# Altium project CorrosenseBoard_V4.2.PrjPcb (part 1 of 2)
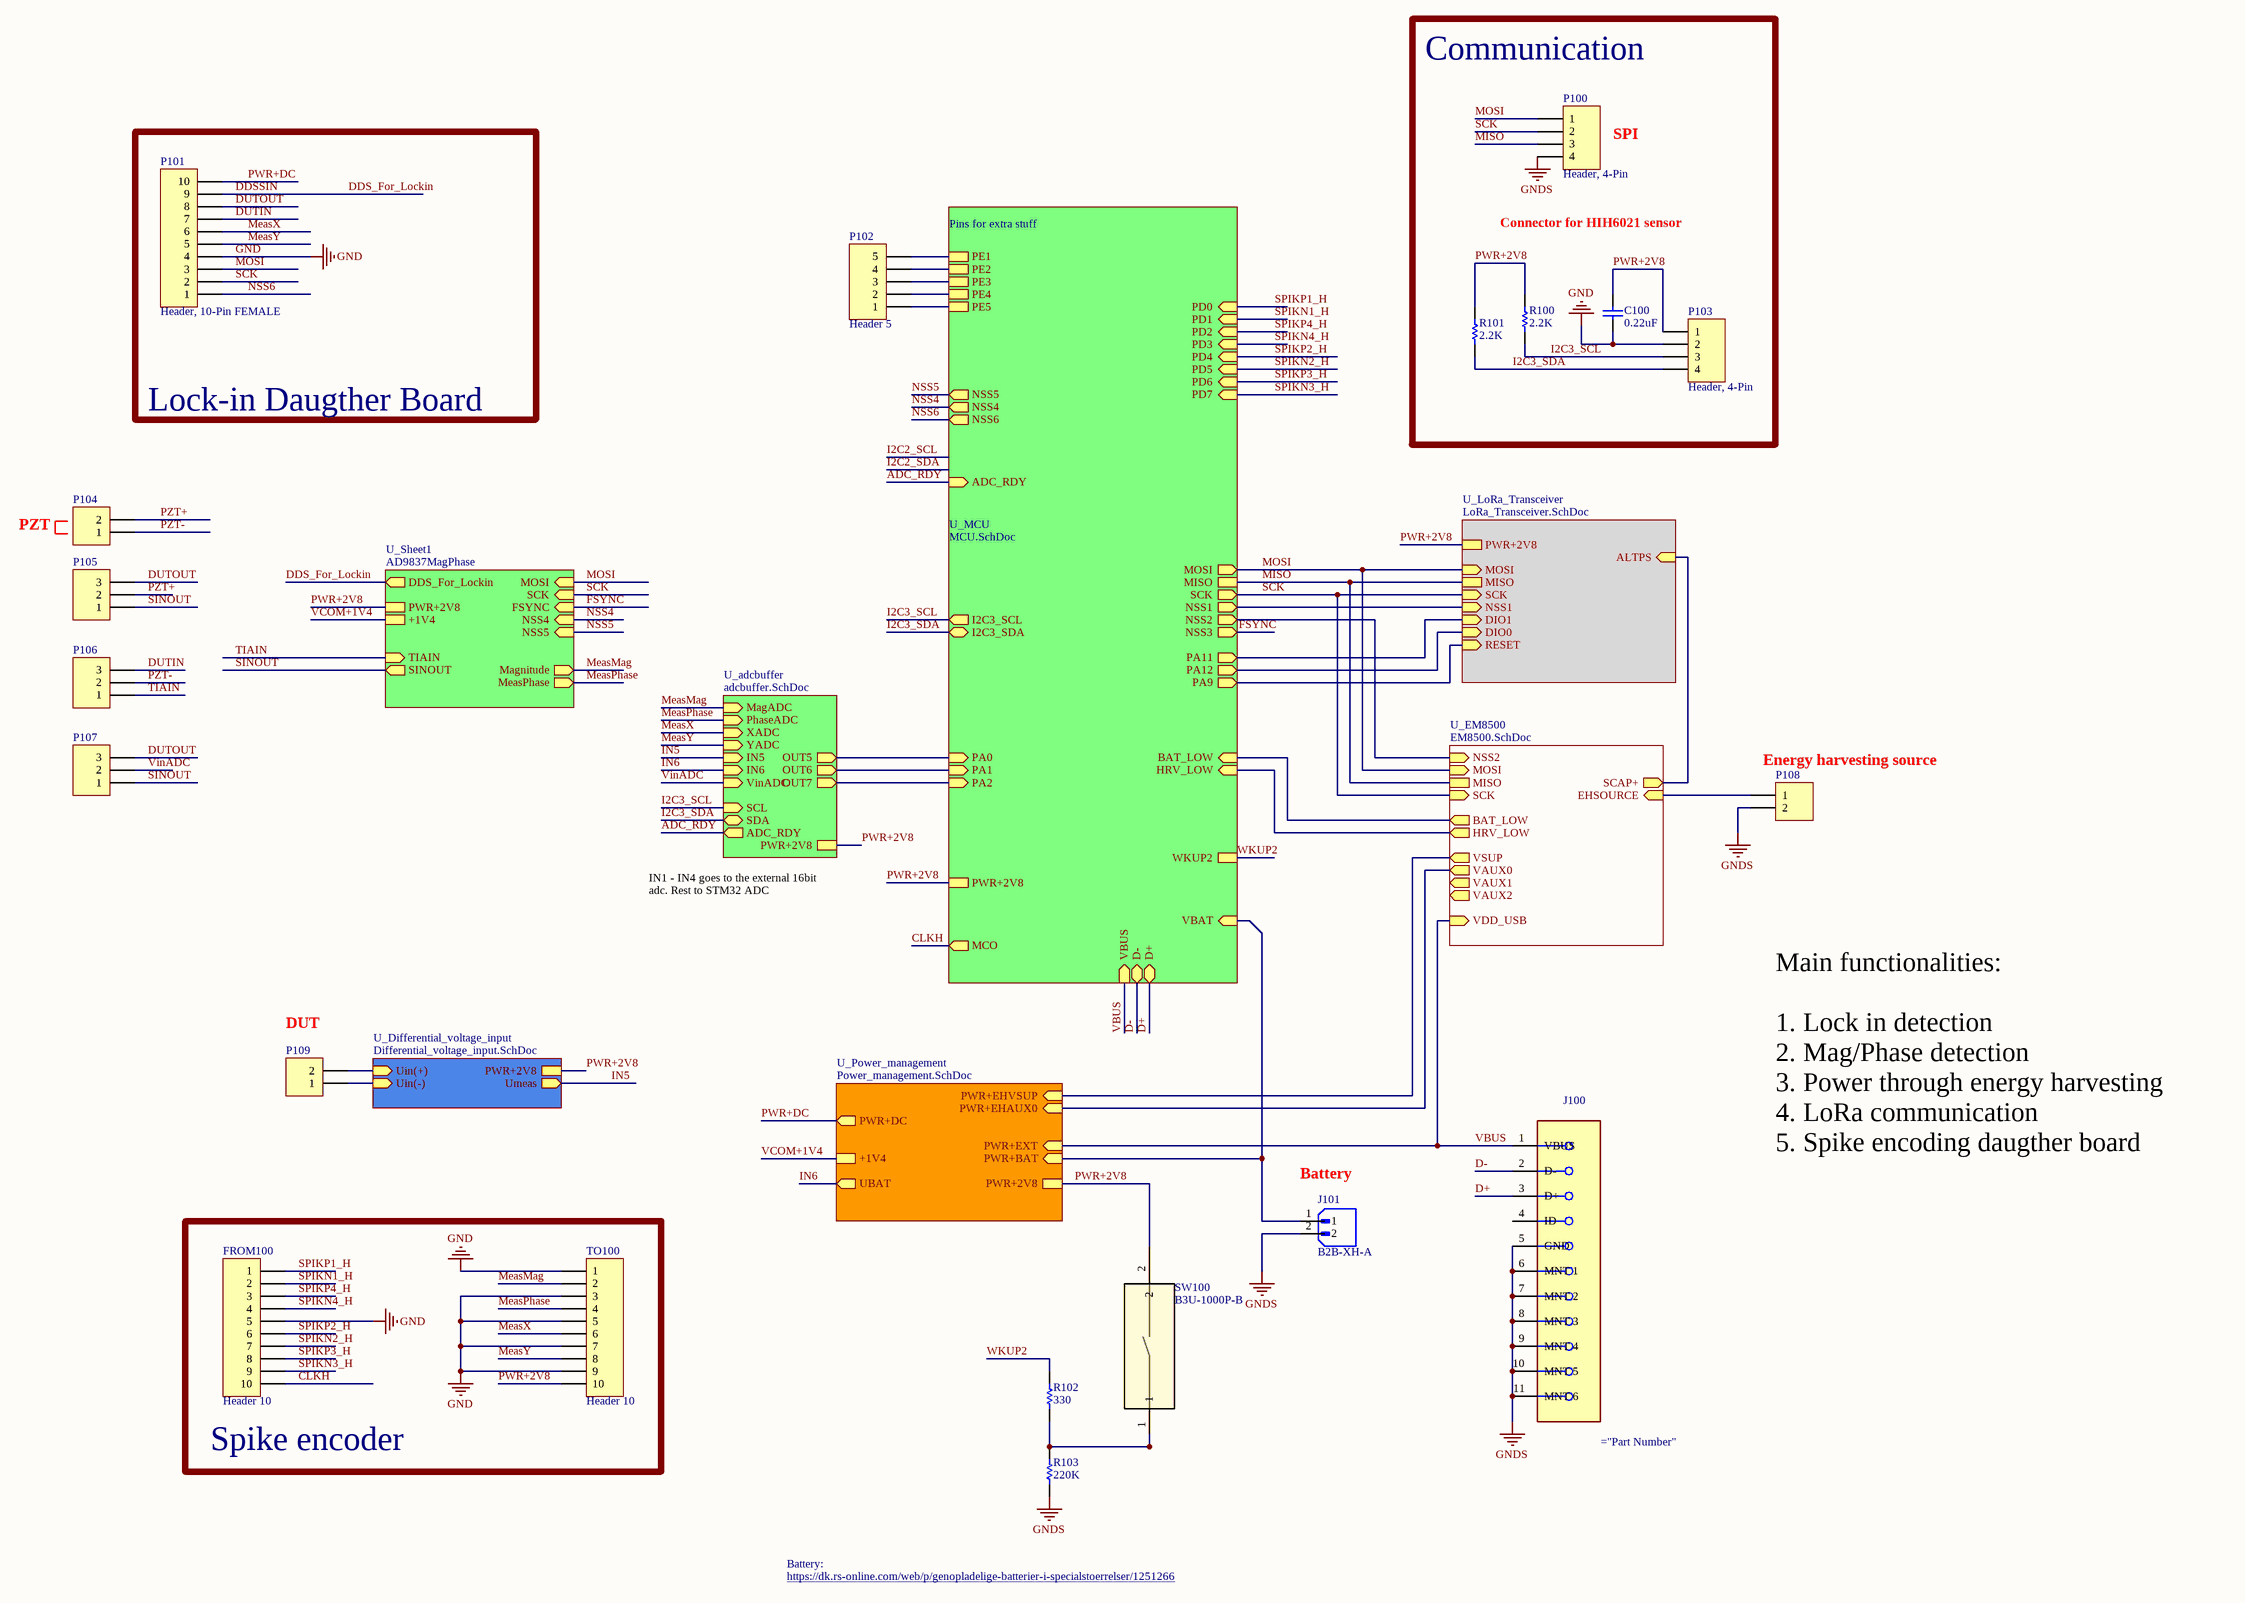
[diagram p0: CorrosenseBoard_V4.2.SchDoc]
8 sheets, 145 parts. Net scope: hierarchical (ports join the sheet entries above them; power ports are global).
Board file: CorrosenseBoardV4_3.PcbDoc
Sheets:
  CorrosenseBoard_V4.2.SchDoc
    U_adcbuffer = adcbuffer.SchDoc
    U_Differential_voltage_input = Differential_voltage_input.SchDoc
    U_EM8500 = EM8500.SchDoc
    U_MCU = MCU.SchDoc
    U_LoRa_Transceiver = LoRa_Transceiver.SchDoc
    U_Power_management = Power_management.SchDoc
    U_Sheet1 = AD9837MagPhase.SchDoc

## Sheet CorrosenseBoard_V4.2.SchDoc
size A2; SheetNumber: 1; SheetTotal: 8; SPICEModelCacheKYAFNCOO: <root> / <DocumentId>KYAFNCOO</DocumentId> / </root>

### Parts
C100  0.22uF  [1608[0603]]
FROM100  Header 10  [HDR1X10]
J100  0473460001  [Molex_0473460001_0]  (value not drawn)
J101  B2B-XH-A  [JST_B2B-XH-A]
P100  Header, 4-Pin  [HDR1X4]
P101  Header, 10-Pin FEMALE  [HDR1X10]
P102  Header 5  [HDR1X5]
P103  Header, 4-Pin  [HDR1X4]
P104  Header, 2-Pin  [HDR1X2]  (value not drawn)
P105  Header, 3-Pin  [HDR1X3]  (value not drawn)
P106  Header, 3-Pin  [HDR1X3]  (value not drawn)
P107  Header, 3-Pin  [HDR1X3]  (value not drawn)
P108  Header, 2-Pin  [HDR1X2]  (value not drawn)
P109  Header, 2-Pin  [HDR1X2]  (value not drawn)
R100  2.2K  [1608[0603]]
R101  2.2K  [1608[0603]]
R102  330  [1608[0603]]
R103  220K  [1608[0603]]
SW100  B3U-1000P-B  [B3U-1000P-B]
TO100  Header 10  [HDR1X10]

### Blocks framed on the sheet
Communication: C100 P100 P103 R100 R101
Lock-in Daugther Board: P101
Spike encoder: FROM100 TO100

### Sub-sheets
U_adcbuffer = adcbuffer.SchDoc: MagADC (in), PhaseADC (in), XADC (in), YADC (in), IN5 (in), OUT5 (out), IN6 (in), OUT6 (out), VinADC (in), OUT7 (out), PWR+2V8, SCL (in), SDA (bidir), ADC_RDY (out)
U_Differential_voltage_input = Differential_voltage_input.SchDoc: Umeas (out), Uin(-) (in), Uin(+) (in), PWR+2V8
U_EM8500 = EM8500.SchDoc: MOSI (in), SCK (in), SCAP+ (out), VAUX2 (out), VAUX1 (out), VAUX0 (out), VSUP (out), BAT_LOW (out), HRV_LOW (out), VDD_USB (in), EHSOURCE (in), NSS2 (in), MISO
U_LoRa_Transceiver = LoRa_Transceiver.SchDoc: ALTPS (in), MOSI (in), SCK (in), RESET (in), NSS1 (in), DIO1 (in), DIO0 (in), PWR+2V8, MISO
U_MCU = MCU.SchDoc: PA0 (in), PA1 (in), PD2 (in), PA9 (out), PA11 (out), PA12 (out), WKUP2, MOSI (out), MISO, SCK (out), NSS1 (out), NSS3 (out), NSS2 (out), VBUS (in), D- (bidir), D+ (bidir), PWR+2V8, VBAT (in), I2C3_SCL (out), I2C3_SDA (bidir), PA2 (in), PD0 (in), PD1 (in), PD3 (in), PD4 (in), PD5 (in), PD6 (in), PD7 (in), PE1, PE2, PE3, PE4, PE5, NSS4 (out), NSS5 (out), ADC_RDY (in), NSS6 (out), MCO (out), HRV_LOW (in), BAT_LOW (in)
U_Power_management = Power_management.SchDoc: PWR+EXT (in), PWR+BAT (in), PWR+EHVSUP (in), PWR+EHAUX0 (in), PWR+2V8, PWR+DC (out), UBAT (out), +1V4
U_Sheet1 = AD9837MagPhase: MOSI (in), SCK (in), FSYNC (in), Magnitude (out), NSS4 (in), SINOUT (out), TIAIN (in), MeasPhase (out), PWR+2V8, +1V4, NSS5 (in), DDS_For_Lockin (out)

### Nets
GND: C100.1 FROM100.5 P101.4 P103.2 TO100.1 TO100.3 TO100.5 TO100.7 TO100.9
GNDS: J100.5(GND) J100.6(MNT_1) J100.7(MNT_2) J100.8(MNT_3) J100.9(MNT_4) J100.10(MNT_5) J100.11(MNT_6) J101.2 P100.4 P108.2 R103.1
ADC_RDY: sheet U_adcbuffer/ADC_RDY, sheet U_MCU/ADC_RDY
ALTPS: sheet U_EM8500/SCAP+, sheet U_LoRa_Transceiver/ALTPS
CLKH: FROM100.10 ; sheet U_MCU/MCO
D+: J100.3(D+) ; sheet U_MCU/D+
D-: J100.2(D-) ; sheet U_MCU/D-
DDS_For_Lockin: P101.9 ; sheet U_Sheet1/DDS_For_Lockin  [also labelled DDSSIN]
DIO0: sheet U_MCU/PA12, sheet U_LoRa_Transceiver/DIO0
DIO1: sheet U_MCU/PA11, sheet U_LoRa_Transceiver/DIO1
DUTIN: P101.7 P106.3
DUTOUT: P101.8 P105.3 P107.3
FSYNC: sheet U_MCU/NSS3, sheet U_Sheet1/FSYNC
I2C3_SCL: P103.3 R100.1 ; sheet U_adcbuffer/SCL, sheet U_MCU/I2C3_SCL
I2C3_SDA: P103.4 R101.1 ; sheet U_adcbuffer/SDA, sheet U_MCU/I2C3_SDA
IN5: sheet U_adcbuffer/IN5, sheet U_Differential_voltage_input/Umeas
IN6: sheet U_adcbuffer/IN6, sheet U_Power_management/UBAT
MeasMag: TO100.2 ; sheet U_adcbuffer/MagADC, sheet U_Sheet1/Magnitude
MeasPhase: TO100.4 ; sheet U_adcbuffer/PhaseADC, sheet U_Sheet1/MeasPhase
MeasX: P101.6 TO100.6 ; sheet U_adcbuffer/XADC
MeasY: P101.5 TO100.8 ; sheet U_adcbuffer/YADC
MISO: P100.3 ; sheet U_EM8500/MISO, sheet U_MCU/MISO, sheet U_LoRa_Transceiver/MISO
MOSI: P100.1 P101.3 ; sheet U_EM8500/MOSI, sheet U_MCU/MOSI, sheet U_LoRa_Transceiver/MOSI, sheet U_Sheet1/MOSI
NSS1: sheet U_MCU/NSS1, sheet U_LoRa_Transceiver/NSS1
NSS4: sheet U_MCU/NSS4, sheet U_Sheet1/NSS4
NSS5: sheet U_MCU/NSS5, sheet U_Sheet1/NSS5
NSS6: P101.1 ; sheet U_MCU/NSS6
PWR+2V8: C100.2 P103.1 R100.2 R101.2 SW100.2 TO100.10 ; sheet U_adcbuffer/PWR+2V8, sheet U_Differential_voltage_input/PWR+2V8, sheet U_MCU/PWR+2V8, sheet U_LoRa_Transceiver/PWR+2V8, sheet U_Power_management/PWR+2V8, sheet U_Sheet1/PWR+2V8
PWR+DC: P101.10 ; sheet U_Power_management/PWR+DC
PZT+: P104.2 P105.2
PZT-: P104.1 P106.2
RESET: sheet U_MCU/PA9, sheet U_LoRa_Transceiver/RESET
SCK: P100.2 P101.2 ; sheet U_EM8500/SCK, sheet U_MCU/SCK, sheet U_LoRa_Transceiver/SCK, sheet U_Sheet1/SCK
SINOUT: P105.1 P107.1 ; sheet U_Sheet1/SINOUT  [project net SIGREF]
SPIKN1_H: FROM100.2 ; sheet U_MCU/PD1
SPIKN2_H: FROM100.7 ; sheet U_MCU/PD5
SPIKN3_H: FROM100.9 ; sheet U_MCU/PD7
SPIKN4_H: FROM100.4 ; sheet U_MCU/PD3
SPIKP1_H: FROM100.1 ; sheet U_MCU/PD0
SPIKP2_H: FROM100.6 ; sheet U_MCU/PD4
SPIKP3_H: FROM100.8 ; sheet U_MCU/PD6
SPIKP4_H: FROM100.3 ; sheet U_MCU/PD2
TIAIN: P106.1 ; sheet U_Sheet1/TIAIN
Uin(+): P109.2 ; sheet U_Differential_voltage_input/Uin(+)
Uin(-): P109.1 ; sheet U_Differential_voltage_input/Uin(-)
VBUS: J100.1(VBUS) ; sheet U_EM8500/VDD_USB, sheet U_MCU/VBUS, sheet U_Power_management/PWR+EXT
VCOM+1V4: sheet U_Power_management/+1V4, sheet U_Sheet1/+1V4  [project net VCOM]
VDD_HRV: P108.1 ; sheet U_EM8500/EHSOURCE
VinADC: P107.2 ; sheet U_adcbuffer/VinADC
WKUP2: R102.2 ; sheet U_MCU/WKUP2
NetC504_1: sheet U_EM8500/VSUP, sheet U_Power_management/PWR+EHVSUP
NetC505_2: sheet U_EM8500/VAUX0, sheet U_Power_management/PWR+EHAUX0
NetIC500_7: sheet U_EM8500/NSS2, sheet U_MCU/NSS2
NetIC500_17: sheet U_EM8500/HRV_LOW, sheet U_MCU/HRV_LOW
NetIC500_18: sheet U_EM8500/BAT_LOW, sheet U_MCU/BAT_LOW
NetJ101_1: J101.1 ; sheet U_MCU/VBAT, sheet U_Power_management/PWR+BAT
NetP102_1: P102.1 ; sheet U_MCU/PE5
NetP102_2: P102.2 ; sheet U_MCU/PE4
NetP102_3: P102.3 ; sheet U_MCU/PE3
NetP102_4: P102.4 ; sheet U_MCU/PE2
NetP102_5: P102.5 ; sheet U_MCU/PE1
NetR102_1: R102.1 R103.2 SW100.1
NetU200_23: sheet U_adcbuffer/OUT5, sheet U_MCU/PA0
NetU200_24: sheet U_adcbuffer/OUT6, sheet U_MCU/PA1
NetU200_25: sheet U_adcbuffer/OUT7, sheet U_MCU/PA2

Not connected (* = marked no-connect by the designer): J100 4(ID)

### Notes on the sheet
- SPI
- Pins for extra stuff
- Connector for HIH6021 sensor
- PZT
- (near P108) Energy harvesting source
- IN1 - IN4 goes to the external 16bit adc. Rest to STM32 ADC
- (near P109) DUT
- (near J101) Battery
- Main functionalities:
  1. Lock in detection
  2. Mag/Phase detection
  3. Power through energy harvesting
  4. LoRa communication
  5. Spike encoding daugther board
- https://dk.rs-online.com/web/p/genopladelige-batterier-i-specialstoerrelser/1251266
- Battery:

### Library data of the parts
C100 = Cap: CAP CER 25V X7R 0603; Manufacturer: Murata Electronics; MPN: GCM188R71E224KA55D; Tolerance: ±10%; Value: 0.22uF; Operating Temperature: -55°C ~ 125°C; Package / Case: 0603 (1608 Metric); Temperature Coefficient: X7R; Voltage - Rated: 25V
FROM100 TO100 = Header 10: Header, 10-Pin; Manufacturer: Wurth Elektronik; MPN: 61301011121; Publisher: Altium Limited
J100 = 0473460001: USB Connectors MICRO USB B RECPT BTTM MOUNT ASSY; Manufacturer: Molex; MPN: 0473460001
J101 = B2B-XH-A: B2B-XH-A(LF)(SN); Manufacturer: JST Commercial; MF: {'manufacturer': u'JST Sales America Inc.'}; Package: None; Price: None; Value: B2B-XH-A(LF)(SN); MP: B2B-XH-A; Availability: Unavailable; MPN: B2B-XH-A(LF)(SN)
P100 P103 = Header 4: Manufacturer: Würth Elektronik; MPN: 61300411121; Publisher: Altium Limited
P101 = Header 10: Header, 10-Pin; Manufacturer: Wurth Elektronik; MPN: 61301011821; Publisher: Altium Limited
P102 = Header 5: Header, 5-Pin; Manufacturer: Würth Elektronik; MPN: 61300511121; Publisher: Altium Limited
P104 P108 P109 = Header 2: Manufacturer: Wurth Elektronik; MPN: 61300211121; Publisher: Altium Limited
P105-P107 = Header 3: Manufacturer: Wurth Elektronik; MPN: 61300311121; Publisher: Altium Limited
R100 = Res1: RES SMD 2% 1.5W 0603; Manufacturer: YAGEO; MPN: RC0603FR-072K2L; Publisher: Altium Limited; Value: 2.2K; Tolerance: 2%; Power (Watts): 1.5W; Composition: Thick Film; Operating Temperature: -65°C ~ 155°C; Package: 0603 (1608 Metric)
R101 = Res1: 1608[0603]; Manufacturer: YAGEO; MPN: RC0603FR-072K2L; Tolerance: 2%; Power (Watts): 1.5W; MP: -65°C ~ 155°C; Publisher: Altium Limited; Value: 2.2K; Composition: Thick Film; Operating Temperature: -65°C ~ 155°C; Code_JEITA: Thick Film; Package: 0603 (1608 Metric); PackageReference: 1.5W; Published: Altium Limited; Temperature Coefficient: 2%
R102 = Res1: 1608[0603]; Manufacturer: YAGEO; MPN: AC0603FR-07330RL; Tolerance: 2%; Power (Watts): 1.5W; MP: -65°C ~ 155°C; Publisher: Altium Limited; Value: 330; Composition: Thick Film; Operating Temperature: -65°C ~ 155°C; Code_JEITA: Thick Film; Package: 0603 (1608 Metric); PackageReference: 1.5W; Published: Altium Limited; Temperature Coefficient: 2%
R103 = Res1: 1608[0603]; Manufacturer: YAGEO; MPN: RC0603FR-07220KL; Tolerance: 2%; Power (Watts): 1.5W; MP: -65°C ~ 155°C; Publisher: Altium Limited; Value: 220K; Composition: Thick Film; Operating Temperature: -65°C ~ 155°C; Code_JEITA: Thick Film; Package: 0603 (1608 Metric); PackageReference: 1.5W; Published: Altium Limited; Temperature Coefficient: 2%
SW100 = B3U-1000P-B: No Description Available; Mfr_Name: Omron; Manufacturer: Omron Electronics; RefDes: RefDes; Type: Type; MPN: B3U-1000P-B

## Sheet adcbuffer.SchDoc
size A4; SheetNumber: 7; SheetTotal: 8
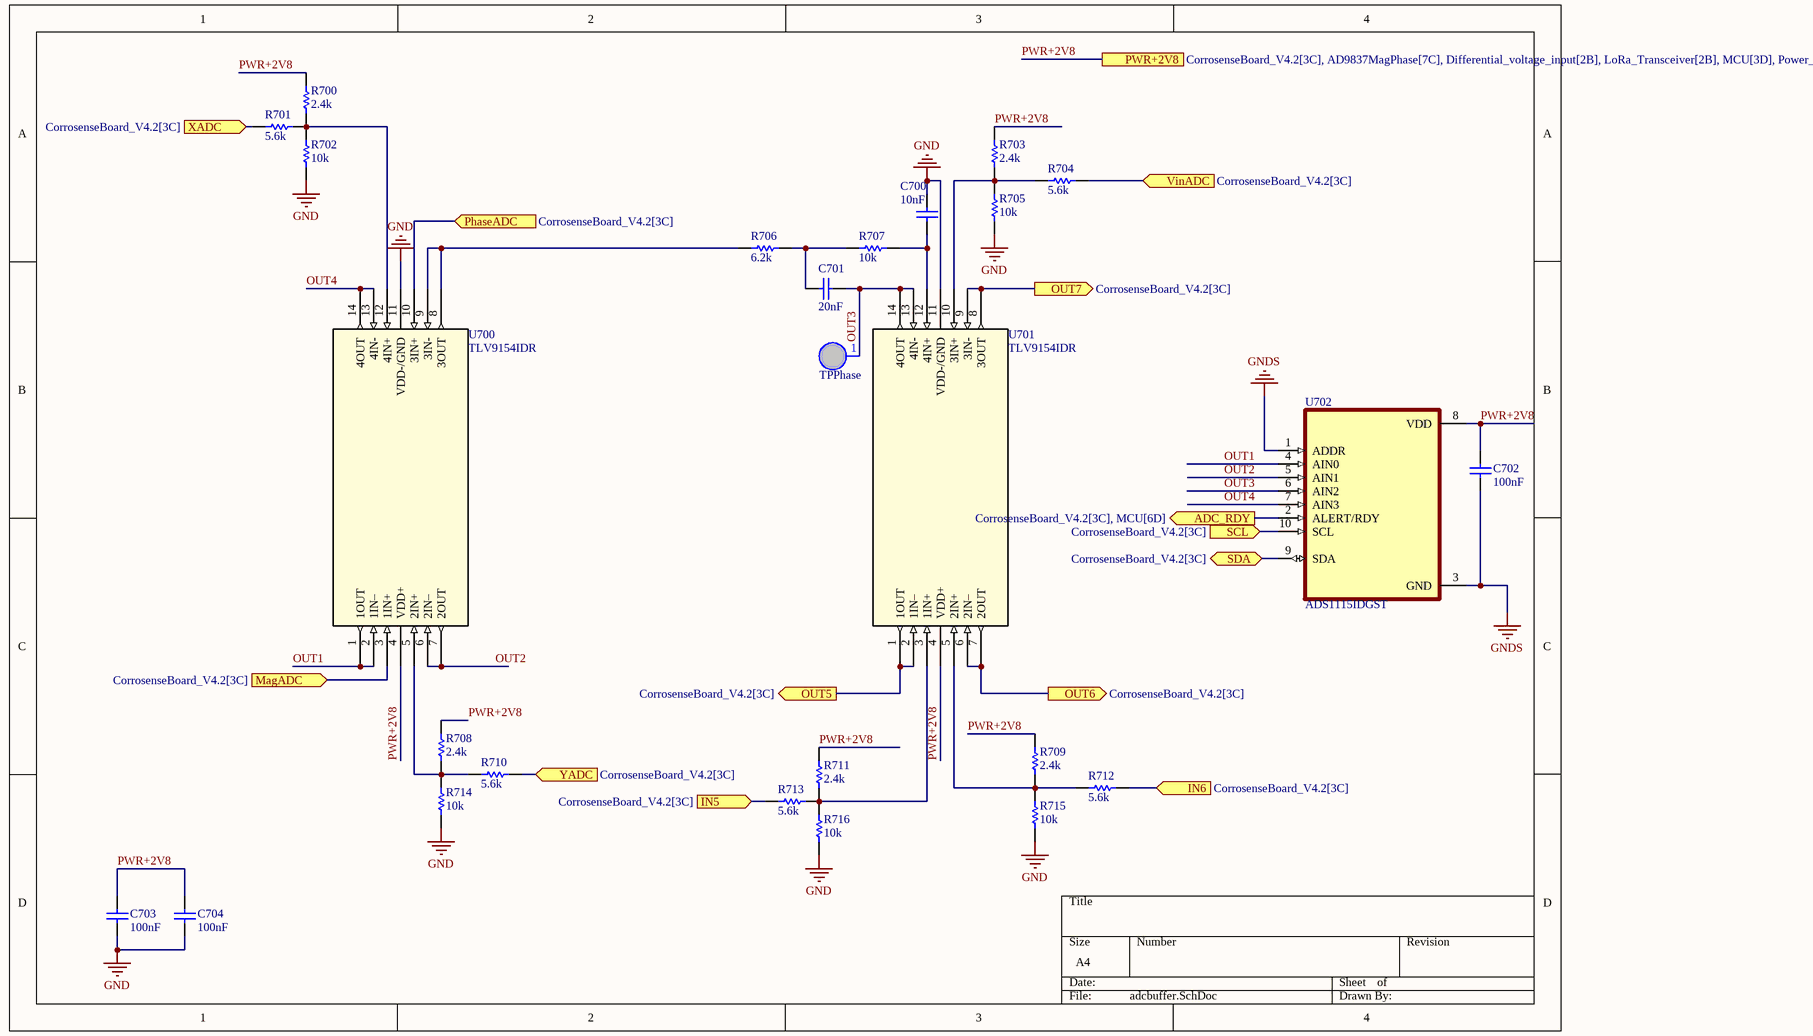
[diagram p1: adcbuffer.SchDoc]

### Parts
C700  10nF  [1608[0603]]
C701  20nF  [1608[0603]]
C702  100nF  [1608[0603]]
C703  100nF  [1608[0603]]
C704  100nF  [1608[0603]]
R700  2.4k  [1608[0603]]
R701  5.6k  [1608[0603]]
R702  10k  [1608[0603]]
R703  2.4k  [1608[0603]]
R704  5.6k  [1608[0603]]
R705  10k  [1608[0603]]
R706  6.2k  [1608[0603]]
R707  10k  [1608[0603]]
R708  2.4k  [1608[0603]]
R709  2.4k  [1608[0603]]
R710  5.6k  [1608[0603]]
R711  2.4k  [1608[0603]]
R712  5.6k  [1608[0603]]
R713  5.6k  [1608[0603]]
R714  10k  [1608[0603]]
R715  10k  [1608[0603]]
R716  10k  [1608[0603]]
TPPhase  TP  [PCBComponent_1]  (value not drawn)  (no BOM)
U700  TLV9154IDR  [SOIC127P600X175-14N]
U701  TLV9154IDR  [SOIC127P600X175-14N]
U702  ADS1115IDGST  [SOP50P490X110-10N]

### Ports
ADC_RDY (out, see CorrosenseBoard_V4.2[3C], MCU[6D]), IN5 (in, see CorrosenseBoard_V4.2[3C]), IN6 (in, see CorrosenseBoard_V4.2[3C]), MagADC (in, see CorrosenseBoard_V4.2[3C]), OUT5 (out, see CorrosenseBoard_V4.2[3C]), OUT6 (out, see CorrosenseBoard_V4.2[3C]), OUT7 (out, see CorrosenseBoard_V4.2[3C]), PhaseADC (in, see CorrosenseBoard_V4.2[3C]), PWR+2V8 (see CorrosenseBoard_V4.2[3C], AD9837MagPhase[7C], Differential_voltage_input[2B], LoRa_Transceiver[2B], MCU[3D], Power_management[3C]), SCL (in, see CorrosenseBoard_V4.2[3C]), SDA (bidir, see CorrosenseBoard_V4.2[3C]), VinADC (in, see CorrosenseBoard_V4.2[3C]), XADC (in, see CorrosenseBoard_V4.2[3C]), YADC (in, see CorrosenseBoard_V4.2[3C])

### Nets
GND: C700.2 C703.2 C704.2 R702.1 R705.1 R714.1 R715.1 R716.1 U700.11(VDD-/GND) U701.11(VDD-/GND)
GNDS: C702.2 U702.1(ADDR) U702.3(GND)
ADC_RDY: U702.2(ALERT/RDY) ; port ADC_RDY
I2C3_SCL: U702.10(SCL) ; port SCL
I2C3_SDA: U702.9(SDA) ; port SDA
IN5: R713.2 ; port IN5
IN6: R712.2 ; port IN6
MeasMag: U700.3(1IN+) ; port MagADC
MeasPhase: U700.10(3IN+) ; port PhaseADC
MeasX: R701.2 ; port XADC
MeasY: R710.2 ; port YADC
OUT1: U700.1(1OUT) U700.2(1IN–) U702.4(AIN0)
OUT2: U700.6(2IN–) U700.7(2OUT) U702.5(AIN1)
OUT3: C701.2 TPPhase.1 U701.13(4IN-) U701.14(4OUT) U702.6(AIN2)
OUT4: U700.13(4IN-) U700.14(4OUT) U702.7(AIN3)
PWR+2V8: C702.1 C703.1 C704.1 R700.2 R703.2 R708.2 R709.2 R711.2 U700.4(VDD+) U701.4(VDD+) U702.8(VDD) ; port PWR+2V8
VinADC: R704.2 ; port VinADC
NetC700_1: C700.1 R707.1 U701.12(4IN+)
NetC701_1: C701.1 R706.1 R707.2
NetR700_1: R700.1 R701.1 R702.2 U700.12(4IN+)
NetR703_1: R703.1 R704.1 R705.2 U701.10(3IN+)
NetR706_2: R706.2 U700.8(3OUT) U700.9(3IN-)
NetR708_1: R708.1 R710.1 R714.2 U700.5(2IN+)
NetR709_1: R709.1 R712.1 R715.2 U701.5(2IN+)
NetR711_1: R711.1 R713.1 R716.2 U701.3(1IN+)
NetU200_23: U701.1(1OUT) U701.2(1IN–) ; port OUT5
NetU200_24: U701.6(2IN–) U701.7(2OUT) ; port OUT6
NetU200_25: U701.8(3OUT) U701.9(3IN-) ; port OUT7

### Library data of the parts
C700 = Cap: CAP CER 25V X7R 0603; Manufacturer: Murata Electronics; MPN: GCJ188R71E103KA01J; Tolerance: ±10%; Value: 10nF; Operating Temperature: -55°C ~ 125°C; Package / Case: 0603 (1608 Metric); Temperature Coefficient: X7R; Voltage - Rated: 25V
C701 = Cap: CAP CER 25V X7R 0603; Manufacturer: YAGEO; MPN: CC0603KRX7R9BB203; Tolerance: ±10%; Value: 20nF; Operating Temperature: -55°C ~ 125°C; Package / Case: 0603 (1608 Metric); Temperature Coefficient: X7R; Voltage - Rated: 25V
C702-C704 = Cap: CAP CER 25V X7R 0603; Manufacturer: Murata Electronics; MPN: GCJ188R71E104KA12D; Tolerance: ±10%; Value: 100nF; Operating Temperature: -55°C ~ 125°C; Package / Case: 0603 (1608 Metric); Temperature Coefficient: X7R; Voltage - Rated: 25V
R700 R703 R708 R709 R711 = Res1: RES SMD 2% 1.5W 0603; Manufacturer: YAGEO; MPN: AC0603FR-072K4L; MP: -65°C ~ 155°C; Publisher: Altium Limited; Value: 2.4k; Code_JEITA: Thick Film; Package: 0603 (1608 Metric); Temperature Coefficient: 2%; Composition: Thick Film; Operating Temperature: -65°C ~ 155°C; Power (Watts): 1.5W; Tolerance: 2%
R701 R704 R710 R712 R713 = Res1: RES SMD 2% 1.5W 0603; Manufacturer: YAGEO; MPN: RC0603FR-075K6L; MP: -65°C ~ 155°C; Publisher: Altium Limited; Value: 5.6k; Code_JEITA: Thick Film; Package: 0603 (1608 Metric); Temperature Coefficient: 2%; Composition: Thick Film; Operating Temperature: -65°C ~ 155°C; Power (Watts): 1.5W; Tolerance: 2%
R702 R705 R707 R714-R716 = Res1: RES SMD 2% 1.5W 0603; Manufacturer: YAGEO; MPN: RC0603FR-0710KL; MP: -65°C ~ 155°C; Publisher: Altium Limited; Value: 10k; Code_JEITA: Thick Film; Package: 0603 (1608 Metric); Temperature Coefficient: 2%; Composition: Thick Film; Operating Temperature: -65°C ~ 155°C; Power (Watts): 1.5W; Tolerance: 2%
R706 = Res1: RES SMD 2% 1.5W 0603; Manufacturer: YAGEO; MPN: AC0603FR-076K2L; MP: -65°C ~ 155°C; Publisher: Altium Limited; Value: 6.2k; Code_JEITA: Thick Film; Package: 0603 (1608 Metric); Temperature Coefficient: 2%; Composition: Thick Film; Operating Temperature: -65°C ~ 155°C; Power (Watts): 1.5W; Tolerance: 2%
U700 U701 = TLV2444CD: No Description Available; Mfr_Name: Texas Instruments; RefDes: RefDes; Type: Type; Manufacturer: Texas Instruments; MPN: TLV9154IDR
U702 = ADS1115IDGST: Manufacturer: Texas Instruments; MP: ADS1115IDGST; Value: *; Price: None; Package: None; Availability: Unavailable; MPN: ADS1115IDGST

## Sheet Differential_voltage_input.SchDoc
size A4; SheetNumber: 6; SheetTotal: 8
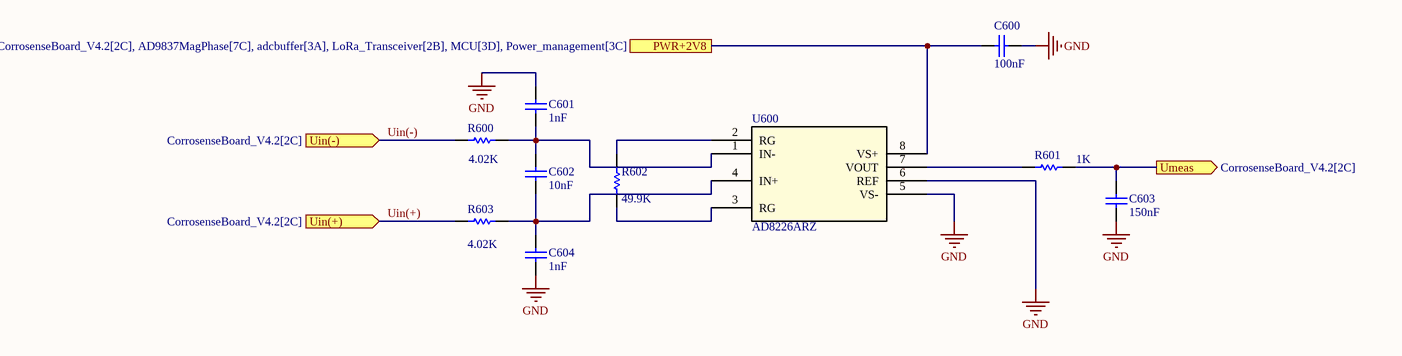
[diagram p2: Differential_voltage_input.SchDoc]

### Parts
C600  100nF  [1608[0603]]
C601  1nF  [1608[0603]]
C602  10nF  [1608[0603]]
C603  150nF  [1608[0603]]
C604  1nF  [1608[0603]]
R600  4.02K  [1608[0603]]
R601  1K  [1608[0603]]
R602  49.9K  [1608[0603]]
R603  4.02K  [1608[0603]]
U600  AD8226ARZ  [SOIC127P600X175-8N]

### Ports
PWR+2V8 (see CorrosenseBoard_V4.2[2C], AD9837MagPhase[7C], adcbuffer[3A], LoRa_Transceiver[2B], MCU[3D], Power_management[3C]), Uin(+) (in, see CorrosenseBoard_V4.2[2C]), Uin(-) (in, see CorrosenseBoard_V4.2[2C]), Umeas (out, see CorrosenseBoard_V4.2[2C])

### Nets
GND: C600.2 C601.1 C603.2 C604.2 U600.5(VS-) U600.6(REF)
IN5: C603.1 R601.2 ; port Umeas
PWR+2V8: C600.1 U600.8(VS+) ; port PWR+2V8
Uin(+): R603.1 ; port Uin(+)
Uin(-): R600.1 ; port Uin(-)
NetC601_2: C601.2 C602.1 R600.2 U600.1(IN-)
NetC602_2: C602.2 C604.1 R603.2 U600.4(IN+)
NetR601_1: R601.1 U600.7(VOUT)
NetR602_1: R602.1 U600.3(RG)
NetR602_2: R602.2 U600.2(RG)

### Library data of the parts
C600 = Cap: as C702 on sheet adcbuffer; Value: 100nF; Operating Temperature: -55°C ~ 125°C; Package / Case: 0603 (1608 Metric); Temperature Coefficient: X7R; Voltage - Rated: 25V
C601 C604 = Cap: CAP CER 25V X7R 0603; Manufacturer: KYOCERA AVX; MPN: 06033C102KAT2A; Tolerance: ±10%; Value: 1nF; Operating Temperature: -55°C ~ 125°C; Package / Case: 0603 (1608 Metric); Temperature Coefficient: X7R; Voltage - Rated: 25V
C602 = Cap: as C700 on sheet adcbuffer; Value: 10nF; Operating Temperature: -55°C ~ 125°C; Package / Case: 0603 (1608 Metric); Temperature Coefficient: X7R; Voltage - Rated: 25V
C603 = Cap: CAP CER 25V X7R 0603; Manufacturer: Murata Electronics; MPN: GRM188R71E154KA01D; Tolerance: ±10%; Value: 150nF; Operating Temperature: -55°C ~ 125°C; Package / Case: 0603 (1608 Metric); Temperature Coefficient: X7R; Voltage - Rated: 25V
R600 R603 = Res1: RES SMD 2% 1.5W 0603; Manufacturer: YAGEO; MPN: AF0603FR-074K02L; MP: -65°C ~ 155°C; Publisher: Altium Limited; Value: 4.02K; Code_JEITA: Thick Film; Package: 0603 (1608 Metric); Temperature Coefficient: 2%; Composition: Thick Film; Operating Temperature: -65°C ~ 155°C; Power (Watts): 1.5W; Tolerance: 2%
R601 = Res1: RES SMD 2% 1.5W 0603; Manufacturer: YAGEO; MPN: RC0603FR-071KL; MP: -65°C ~ 155°C; Publisher: Altium Limited; Value: 1K; Code_JEITA: Thick Film; Package: 0603 (1608 Metric); Temperature Coefficient: 2%; Composition: Thick Film; Operating Temperature: -65°C ~ 155°C; Power (Watts): 1.5W; Tolerance: 2%
R602 = Res1: RES SMD 2% 1.5W 0603; Manufacturer: YAGEO; MPN: AC0603FR-0749K9L; MP: -65°C ~ 155°C; Publisher: Altium Limited; Value: 49.9K; Code_JEITA: Thick Film; Package: 0603 (1608 Metric); Temperature Coefficient: 2%; Composition: Thick Film; Operating Temperature: -65°C ~ 155°C; Power (Watts): 1.5W; Tolerance: 2%
U600 = AD8226ARZ: No Description Available; Mfr_Name: Analog Devices Inc; RefDes: RefDes; Type: Type; Manufacturer: Analog Devices Inc; MPN: AD8226ARZ

## Sheet EM8500.SchDoc
size A3; SheetNumber: 5; SheetTotal: 8
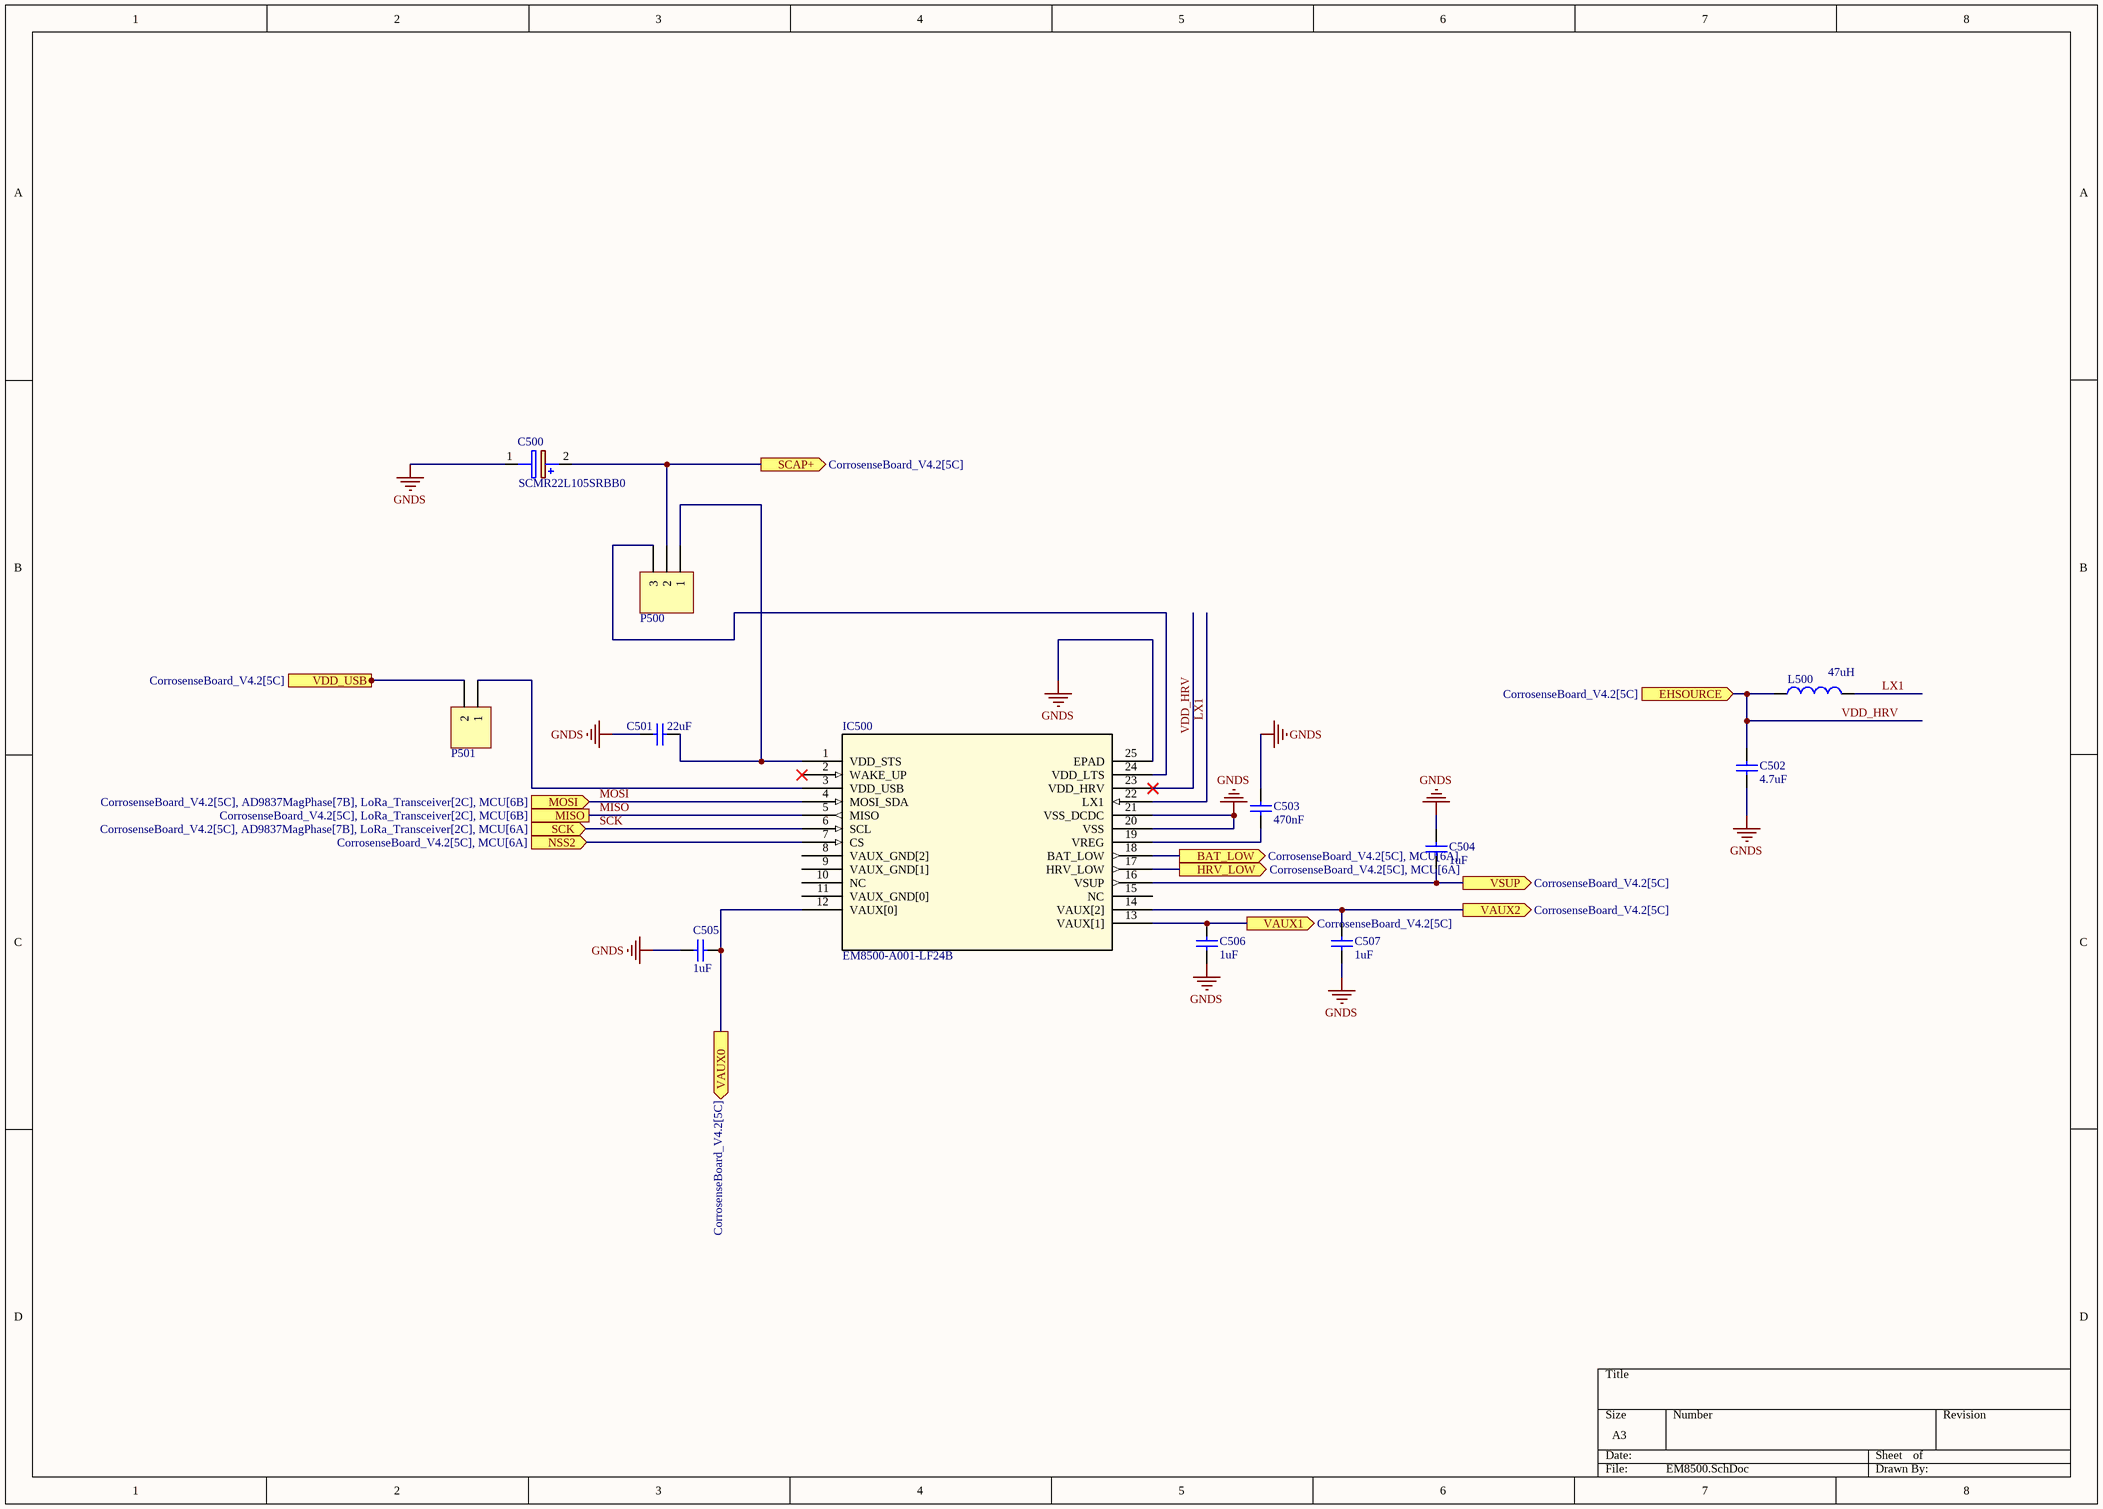
[diagram p3: EM8500.SchDoc]

### Parts
C500  SCMR22L105SRBB0  [SCMR22L105SRBB0]
C501  22uF  [1608[0603]]
C502  4.7uF  [1608[0603]]
C503  470nF  [1608[0603]]
C504  1uF  [1608[0603]]
C505  1uF  [1608[0603]]
C506  1uF  [1608[0603]]
C507  1uF  [1608[0603]]
IC500  EM8500-A001-LF24B  [QFN24_4X4_MAR]
L500  47uH  [C0805]
P500  Header, 3-Pin  [HDR1X3]  (value not drawn)
P501  Header, 2-Pin  [HDR1X2]  (value not drawn)

### Ports
BAT_LOW (out, see CorrosenseBoard_V4.2[5C], MCU[6A]), EHSOURCE (in, see CorrosenseBoard_V4.2[5C]), HRV_LOW (out, see CorrosenseBoard_V4.2[5C], MCU[6A]), MISO (see CorrosenseBoard_V4.2[5C], LoRa_Transceiver[2C], MCU[6B]), MOSI (in, see CorrosenseBoard_V4.2[5C], AD9837MagPhase[7B], LoRa_Transceiver[2C], MCU[6B]), NSS2 (in, see CorrosenseBoard_V4.2[5C], MCU[6A]), SCAP+ (out, see CorrosenseBoard_V4.2[5C]), SCK (in, see CorrosenseBoard_V4.2[5C], AD9837MagPhase[7B], LoRa_Transceiver[2C], MCU[6A]), VAUX0 (out, see CorrosenseBoard_V4.2[5C]), VAUX1 (out, see CorrosenseBoard_V4.2[5C]), VAUX2 (out, see CorrosenseBoard_V4.2[5C]), VDD_USB (in, see CorrosenseBoard_V4.2[5C]), VSUP (out, see CorrosenseBoard_V4.2[5C])

### Nets
GNDS: C500.1(-) C501.1 C502.1 C503.1 C504.2 C505.1 C506.1 C507.1 IC500.20(VSS) IC500.21(VSS_DCDC) IC500.25(EPAD)
ALTPS: C500.2(+) P500.2 ; port SCAP+
LX1: IC500.22(LX1) L500.2
MISO: IC500.5(MISO) ; port MISO
MOSI: IC500.4(MOSI_SDA) ; port MOSI
SCK: IC500.6(SCL) ; port SCK
VBUS: P501.2 ; port VDD_USB
VDD_HRV: C502.2 IC500.23(VDD_HRV) L500.1 ; port EHSOURCE
NetC501_2: C501.2 IC500.1(VDD_STS) P500.1
NetC503_2: C503.2 IC500.19(VREG)
NetC504_1: C504.1 IC500.16(VSUP) ; port VSUP
NetC505_2: C505.2 IC500.12(VAUX[0]) ; port VAUX0
NetC506_2: C506.2 IC500.13(VAUX[1]) ; port VAUX1
NetC507_2: C507.2 IC500.14(VAUX[2]) ; port VAUX2
NetIC500_3: IC500.3(VDD_USB) P501.1
NetIC500_7: IC500.7(CS) ; port NSS2
NetIC500_17: IC500.17(HRV_LOW) ; port HRV_LOW
NetIC500_18: IC500.18(BAT_LOW) ; port BAT_LOW
NetIC500_24: IC500.24(VDD_LTS) P500.3

Not connected (* = marked no-connect by the designer): IC500 2(WAKE_UP)* 8(VAUX_GND[2]) 9(VAUX_GND[1]) 10(NC) 11(VAUX_GND[0]) 15(NC)

### Library data of the parts
C500 = SCMR22L105SRBB0: Capacitor Polarised; Manufacturer_Name: Kyocera AVX; Temperature Coefficient: X7R; Tolerance: ±10%; Voltage - Rated: 25V; Datasheet Link: https://datasheet.datasheetarchive.com/originals/distributors/Datasheets_SAMA/1acd652de717f0406628b513d6ceaee9.pdf; Height: 22mm; Manufacturer_Part_Number: SCMR22L105SRBB0; Mouser Part Number: 581-SCMR22L105SRBB0; Mouser Price/Stock: https://www.mouser.co.uk/ProductDetail/AVX/SCMR22L105SRBB0?qs=qSfuJ%252Bfl%2Fd5S4%2FZjZ0mbDA%3D%3D; Arrow Part Number: SCMR22L105SRBB0; Arrow Price/Stock: https://www.arrow.com/en/products/scmr22l105srbb0/avx; Operating Temperature: -55°C ~ 125°C; Package / Case: 0603 (1608 Metric); Manufacturer: Kyocera AVX; MPN: SCMR22L105SRBB0
C501 = Cap: CAP CER 25V X7R 0603; Manufacturer: Murata Electronics; MPN: GRM188C61E226ME01J; Tolerance: ±10%; Value: 22uF; Operating Temperature: -55°C ~ 125°C; Package / Case: 0603 (1608 Metric); Temperature Coefficient: X7R; Voltage - Rated: 25V
C502 = Cap: CAP CER 25V X7R 0603; Manufacturer: Murata Electronics; MPN: GRM188R61E475KE11J; Tolerance: ±10%; Value: 4.7uF; Operating Temperature: -55°C ~ 125°C; Package / Case: 0603 (1608 Metric); Temperature Coefficient: X7R; Voltage - Rated: 25V
C503 = Cap: CAP CER 25V X7R 0603; Manufacturer: Murata Electronics; MPN: GCM188R71E474KA64D; Tolerance: ±10%; Value: 470nF; Operating Temperature: -55°C ~ 125°C; Package / Case: 0603 (1608 Metric); Temperature Coefficient: X7R; Voltage - Rated: 25V
C504-C507 = Cap: CAP CER 25V X7R 0603; Manufacturer: Murata Electronics; MPN: GCM188R71E105KA64D; Tolerance: ±10%; Value: 1uF; Operating Temperature: -55°C ~ 125°C; Package / Case: 0603 (1608 Metric); Temperature Coefficient: X7R; Voltage - Rated: 25V
IC500 = EM8500-A001-LF24B: No Description Available; Mfr_Name: EM Microelectronic-Marin; MPN: EM8500-A001-LF24B+; Digi-Key_Part_Number_3: 2651-EM8500-A001-LF24B+DKR-ND; Digi-Key_Part_Number_2: 2651-EM8500-A001-LF24B+CT-ND; Digi-Key_Part_Number_1: 2651-EM8500-A001-LF24B+TR-ND; RefDes: RefDes; Type: Type; Manufacturer: EM Microelectronic-Marin
L500 = Inductor: Manufacturer: TAIYO YUDEN; MPN: BRL2012T470M; Code_IEC: 1005; Published: 8-Jun-2000; Publisher: Altium Limited; Code_JEITA: 0402; Value: 47uH
P500 = Header 3: as P105 on sheet CorrosenseBoard_V4.2; Publisher: Altium Limited
P501 = Header 2: as P104 on sheet CorrosenseBoard_V4.2; Publisher: Altium Limited

## Sheet MCU.SchDoc
size A3; SheetNumber: 2; SheetTotal: 8; SPICEModelCacheHYEPGFFD: <root> / <DocumentId>HYEPGFFD</DocumentId> / </root>
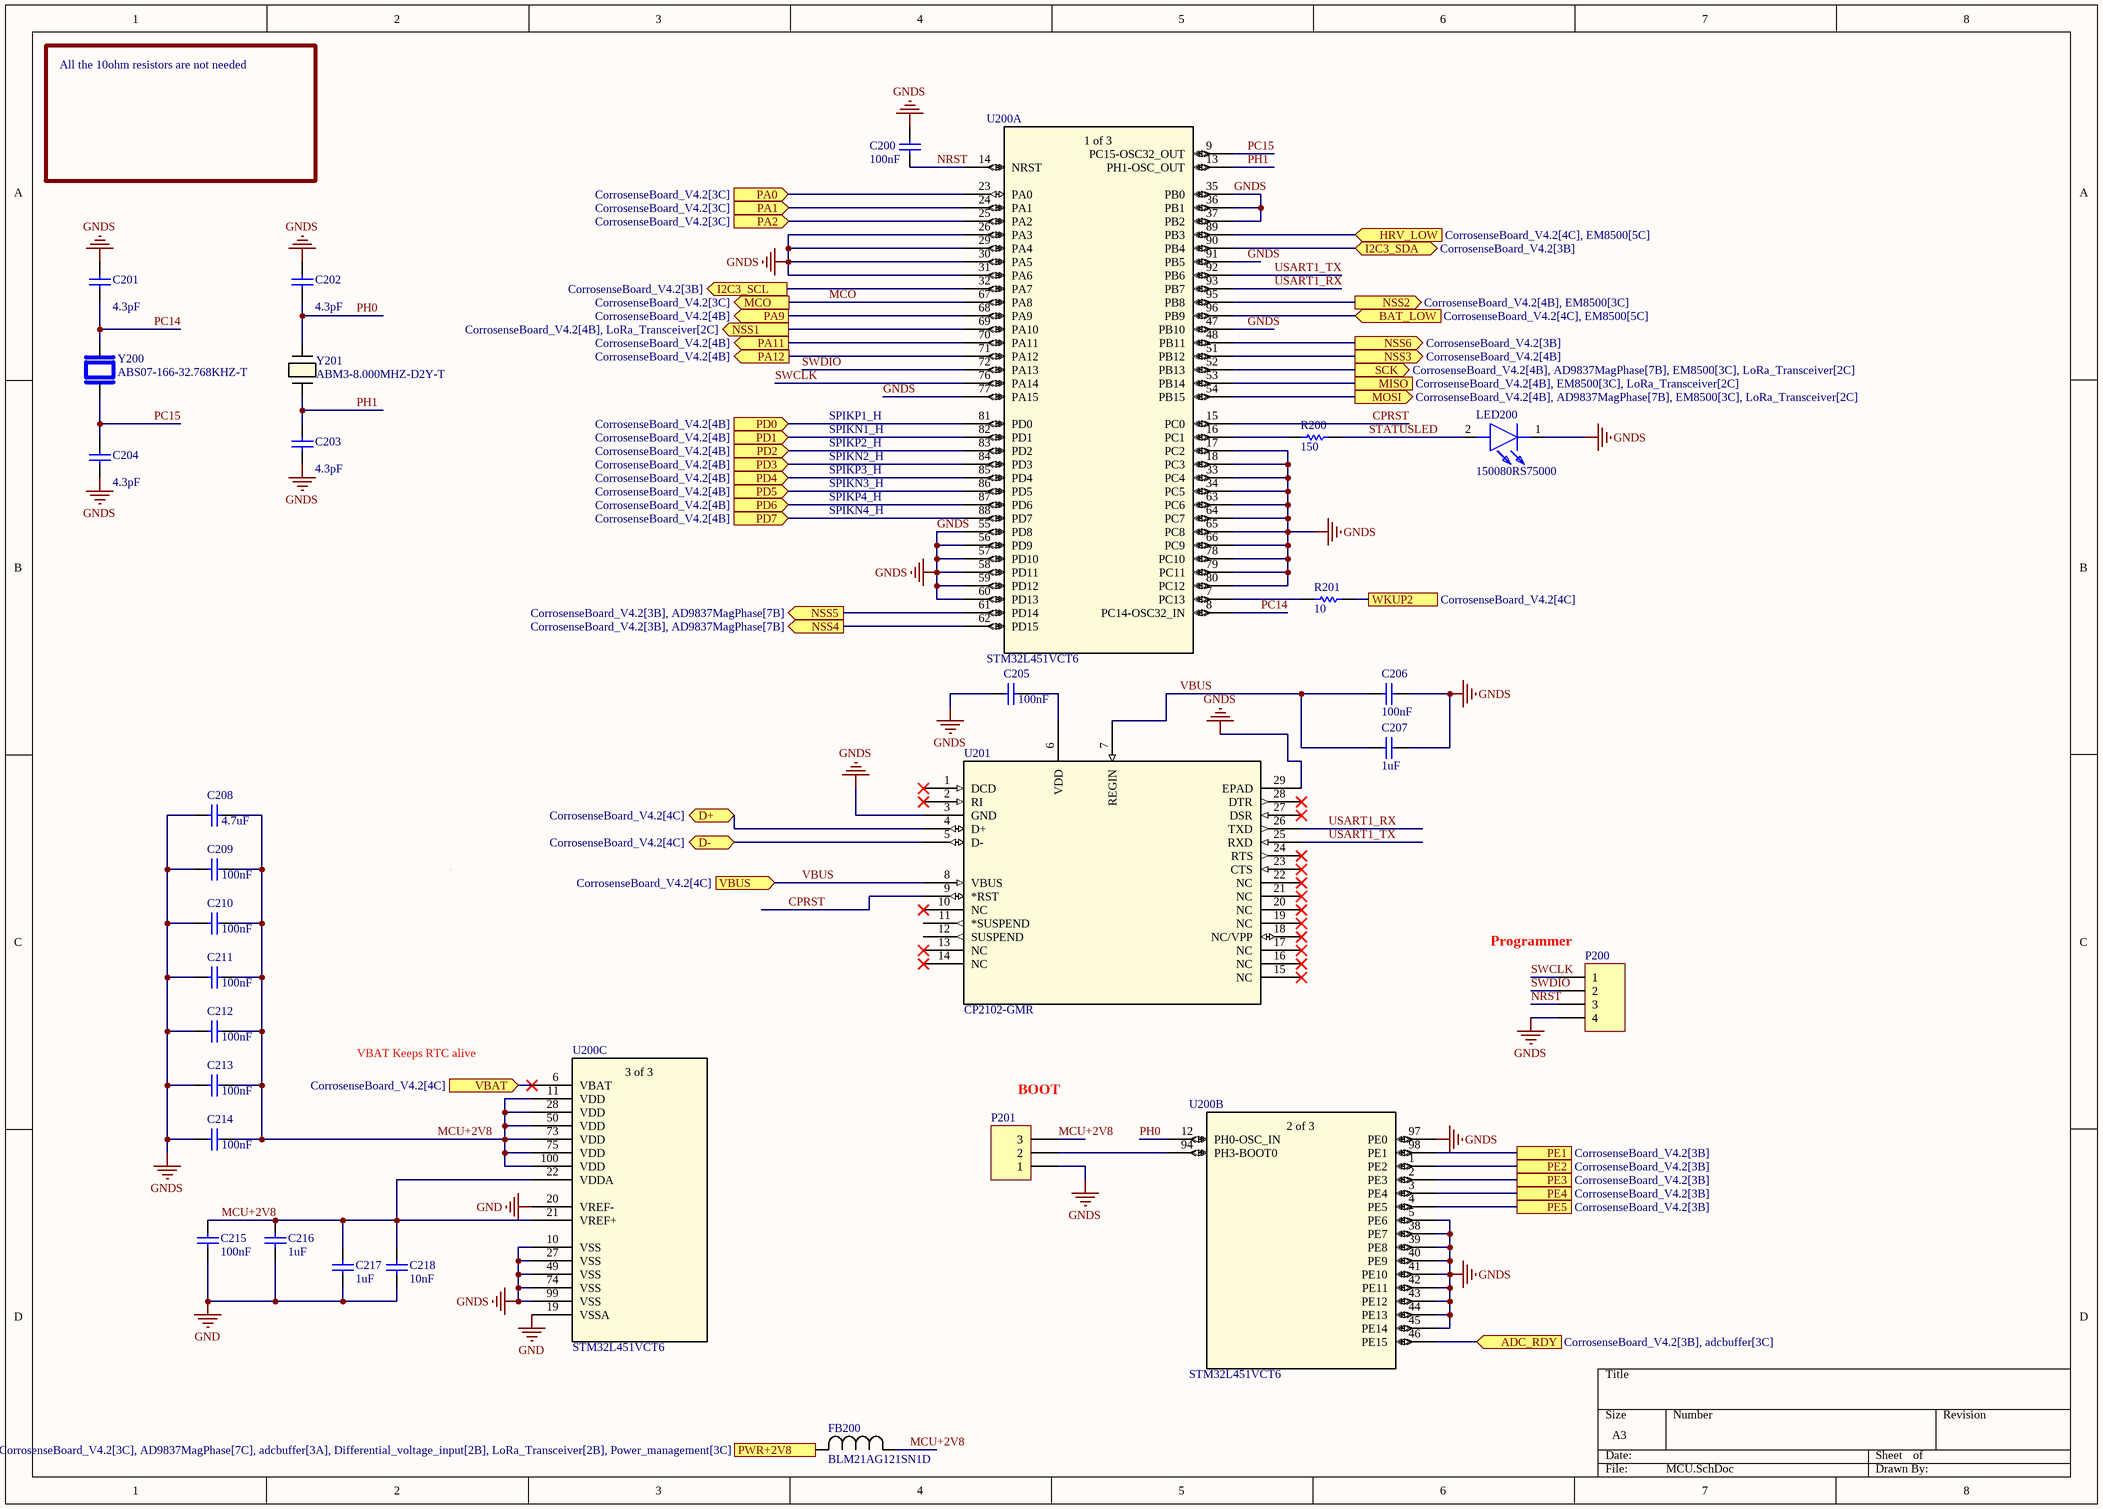
[diagram p4: MCU.SchDoc]

### Parts
C200  100nF  [1608[0603]]
C201  4.3pF  [1608[0603]]
C202  4.3pF  [1608[0603]]
C203  4.3pF  [1608[0603]]
C204  4.3pF  [1608[0603]]
C205  100nF  [1608[0603]]
C206  100nF  [1608[0603]]
C207  1uF  [1608[0603]]
C208  4.7uF  [1608[0603]]
C209  100nF  [1608[0603]]
C210  100nF  [1608[0603]]
C211  100nF  [1608[0603]]
C212  100nF  [1608[0603]]
C213  100nF  [1608[0603]]
C214  100nF  [1608[0603]]
C215  100nF  [1608[0603]]
C216  1uF  [1608[0603]]
C217  1uF  [1608[0603]]
C218  10nF  [1608[0603]]
FB200  BLM21AG121SN1D  [BEADC2012X105N]
LED200  150080RS75000  [LEDC2012X80N]
P200  Header, 4-Pin  [HDR1X4]  (value not drawn)
P201  Header, 3-Pin  [HDR1X3]  (value not drawn)
R200  150  [1608[0603]]
R201  10  [1608[0603]]
U200  STM32L451VCT6  [LQFP100-14x14mm_STM]  (parts A,B,C of 3)
U201  CP2102-GMR  [QFN50P500X500X100-29N-D]
Y200  ABS07-166-32.768KHZ-T  [XTAL_ABS07-166-32.768KHZ-T]
Y201  ABM3-8.000MHZ-D2Y-T  [XTAL_ABM3-8.000MHZ-D2Y-T]

### Ports
ADC_RDY (in, see CorrosenseBoard_V4.2[3B], adcbuffer[3C]), BAT_LOW (in, see CorrosenseBoard_V4.2[4C], EM8500[5C]), D+ (bidir, see CorrosenseBoard_V4.2[4C]), D- (bidir, see CorrosenseBoard_V4.2[4C]), HRV_LOW (in, see CorrosenseBoard_V4.2[4C], EM8500[5C]), I2C3_SCL (out, see CorrosenseBoard_V4.2[3B]), I2C3_SDA (bidir, see CorrosenseBoard_V4.2[3B]), MCO (out, see CorrosenseBoard_V4.2[3C]), MISO (see CorrosenseBoard_V4.2[4B], EM8500[3C], LoRa_Transceiver[2C]), MOSI (out, see CorrosenseBoard_V4.2[4B], AD9837MagPhase[7B], EM8500[3C], LoRa_Transceiver[2C]), NSS1 (out, see CorrosenseBoard_V4.2[4B], LoRa_Transceiver[2C]), NSS2 (out, see CorrosenseBoard_V4.2[4B], EM8500[3C]), NSS3 (out, see CorrosenseBoard_V4.2[4B]), NSS4 (out, see CorrosenseBoard_V4.2[3B], AD9837MagPhase[7B]), NSS5 (out, see CorrosenseBoard_V4.2[3B], AD9837MagPhase[7B]), NSS6 (out, see CorrosenseBoard_V4.2[3B]), PA0 (in, see CorrosenseBoard_V4.2[3C]), PA1 (in, see CorrosenseBoard_V4.2[3C]), PA2 (in, see CorrosenseBoard_V4.2[3C]), PA9 (out, see CorrosenseBoard_V4.2[4B]), PA11 (out, see CorrosenseBoard_V4.2[4B]), PA12 (out, see CorrosenseBoard_V4.2[4B]), PD0 (in, see CorrosenseBoard_V4.2[4B]), PD1 (in, see CorrosenseBoard_V4.2[4B]), PD2 (in, see CorrosenseBoard_V4.2[4B]), PD3 (in, see CorrosenseBoard_V4.2[4B]), PD4 (in, see CorrosenseBoard_V4.2[4B]), PD5 (in, see CorrosenseBoard_V4.2[4B]), PD6 (in, see CorrosenseBoard_V4.2[4B]), PD7 (in, see CorrosenseBoard_V4.2[4B]), PE1 (see CorrosenseBoard_V4.2[3B]), PE2 (see CorrosenseBoard_V4.2[3B]), PE3 (see CorrosenseBoard_V4.2[3B]), PE4 (see CorrosenseBoard_V4.2[3B]), PE5 (see CorrosenseBoard_V4.2[3B]), PWR+2V8 (see CorrosenseBoard_V4.2[3C], AD9837MagPhase[7C], adcbuffer[3A], Differential_voltage_input[2B], LoRa_Transceiver[2B], Power_management[3C]), SCK (out, see CorrosenseBoard_V4.2[4B], AD9837MagPhase[7B], EM8500[3C], LoRa_Transceiver[2C]), VBAT (in, see CorrosenseBoard_V4.2[4C]), VBUS (in, see CorrosenseBoard_V4.2[4C]), WKUP2 (see CorrosenseBoard_V4.2[4C])

### Nets
GND: C215.1 C216.1 C217.1 C218.1 U200.19(VSSA) U200.20(VREF-)
GNDS: C200.2 C201.2 C202.2 C203.1 C204.1 C205.1 C206.1 C207.1 C208.1 C209.1 C210.1 C211.1 C212.1 C213.1 C214.1 LED200.1(K) P200.4 P201.1 U200.5(PE6) U200.10(VSS) U200.17(PC2) U200.18(PC3) U200.26(PA3) U200.27(VSS) U200.29(PA4) U200.30(PA5) U200.31(PA6) U200.33(PC4) U200.34(PC5) U200.35(PB0) U200.36(PB1) U200.37(PB2) U200.38(PE7) U200.39(PE8) U200.40(PE9) U200.41(PE10) U200.42(PE11) U200.43(PE12) U200.44(PE13) U200.45(PE14) U200.47(PB10) U200.49(VSS) U200.55(PD8) U200.56(PD9) U200.57(PD10) U200.58(PD11) U200.59(PD12) U200.60(PD13) U200.63(PC6) U200.64(PC7) U200.65(PC8) U200.66(PC9) U200.74(VSS) U200.77(PA15) U200.78(PC10) U200.79(PC11) U200.80(PC12) U200.91(PB5) U200.97(PE0) U200.99(VSS) U201.3(GND) U201.29(EPAD)
ADC_RDY: U200.46(PE15) ; port ADC_RDY
CPRST: U200.15(PC0) U201.9(*RST)
D+: U201.4(D+) ; port D+
D-: U201.5(D-) ; port D-
DIO0: U200.71(PA12) ; port PA12
DIO1: U200.70(PA11) ; port PA11
FSYNC: U200.51(PB12) ; port NSS3
I2C3_SCL: U200.32(PA7) ; port I2C3_SCL
I2C3_SDA: U200.90(PB4) ; port I2C3_SDA
MCO: U200.67(PA8) ; port MCO  [project net CLKH]
MCU+2V8: C208.2 C209.2 C210.2 C211.2 C212.2 C213.2 C214.2 C215.2 C216.2 C217.2 C218.2 FB200.1 P201.3 U200.11(VDD) U200.21(VREF+) U200.22(VDDA) U200.28(VDD) U200.50(VDD) U200.73(VDD) U200.75(VDD) U200.100(VDD)
MISO: U200.53(PB14) ; port MISO
MOSI: U200.54(PB15) ; port MOSI
NRST: C200.1 P200.3 U200.14(NRST)
NSS1: U200.69(PA10) ; port NSS1
NSS4: U200.62(PD15) ; port NSS4
NSS5: U200.61(PD14) ; port NSS5
NSS6: U200.48(PB11) ; port NSS6
PC14: C201.1 U200.8(PC14-OSC32_IN) Y200.2
PC15: C204.2 U200.9(PC15-OSC32_OUT) Y200.1
PH0: C202.1 U200.12(PH0-OSC_IN) Y201.2
PH1: C203.2 U200.13(PH1-OSC_OUT) Y201.1
PWR+2V8: FB200.2 ; port PWR+2V8
RESET: U200.68(PA9) ; port PA9
SCK: U200.52(PB13) ; port SCK
SPIKN1_H: U200.82(PD1) ; port PD1
SPIKN2_H: U200.86(PD5) ; port PD5
SPIKN3_H: U200.88(PD7) ; port PD7
SPIKN4_H: U200.84(PD3) ; port PD3
SPIKP1_H: U200.81(PD0) ; port PD0
SPIKP2_H: U200.85(PD4) ; port PD4
SPIKP3_H: U200.87(PD6) ; port PD6
SPIKP4_H: U200.83(PD2) ; port PD2
STATUSLED: LED200.2(A) R200.2
SWCLK: P200.1 U200.76(PA14)
SWDIO: P200.2 U200.72(PA13)
USART1_RX: U200.93(PB7) U201.26(TXD)
USART1_TX: U200.92(PB6) U201.25(RXD)
VBUS: C206.2 C207.2 U201.7(REGIN) U201.8(VBUS) ; port VBUS
WKUP2: R201.1 ; port WKUP2
NetC205_2: C205.2 U201.6(VDD)
NetIC500_7: U200.95(PB8) ; port NSS2
NetIC500_17: U200.89(PB3) ; port HRV_LOW
NetIC500_18: U200.96(PB9) ; port BAT_LOW
NetJ101_1: U200.6(VBAT) ; port VBAT
NetP102_1: U200.4(PE5) ; port PE5
NetP102_2: U200.3(PE4) ; port PE4
NetP102_3: U200.2(PE3) ; port PE3
NetP102_4: U200.1(PE2) ; port PE2
NetP102_5: U200.98(PE1) ; port PE1
NetP201_2: P201.2 U200.94(PH3-BOOT0)
NetR200_1: R200.1 U200.16(PC1)
NetR201_2: R201.2 U200.7(PC13)
NetU200_23: U200.23(PA0) ; port PA0
NetU200_24: U200.24(PA1) ; port PA1
NetU200_25: U200.25(PA2) ; port PA2

Not connected (* = marked no-connect by the designer): U201 1(DCD)* 2(RI)* 10(NC)* 11(*SUSPEND) 12(SUSPEND) 13(NC)* 14(NC)* 15(NC)* 16(NC)* 17(NC)* 18(NC/VPP)* 19(NC)* 20(NC)* 21(NC)* 22(NC)* 23(CTS)* 24(RTS)* 27(DSR)* 28(DTR)*

### Notes on the sheet
- All the 10ohm resistors are not needed
- SPIKP1_H
- SPIKN1_H
- SPIKP2_H
- SPIKN2_H
- SPIKN3_H
- SPIKN4_H
- SPIKP4_H
- SPIKP3_H
- (near P200) Programmer
- (near U200) VBAT Keeps RTC alive
- (near P201) BOOT
- (in symbol STM32L451VCT6, part A) 1 of 3
- (in symbol STM32L451VCT6, part B) 2 of 3
- (in symbol STM32L451VCT6, part C) 3 of 3

### Library data of the parts
C200 C205 C206 C209-C215 = Cap: as C702 on sheet adcbuffer; Value: 100nF; Operating Temperature: -55°C ~ 125°C; Package / Case: 0603 (1608 Metric); Temperature Coefficient: X7R; Voltage - Rated: 25V
C201-C204 = Cap: CAP CER 25V X7R 0603; Manufacturer: KYOCERA AVX; MPN: 06035A4R3CAT2A; Tolerance: ±10%; Value: 4.3pF; Operating Temperature: -55°C ~ 125°C; Package / Case: 0603 (1608 Metric); Temperature Coefficient: X7R; Voltage - Rated: 25V
C207 C216 C217 = Cap: as C504 on sheet EM8500; Value: 1uF; Operating Temperature: -55°C ~ 125°C; Package / Case: 0603 (1608 Metric); Temperature Coefficient: X7R; Voltage - Rated: 25V
C208 = Cap: as C502 on sheet EM8500; Value: 4.7uF; Operating Temperature: -55°C ~ 125°C; Package / Case: 0603 (1608 Metric); Temperature Coefficient: X7R; Voltage - Rated: 25V
C218 = Cap: as C700 on sheet adcbuffer; Value: 10nF; Operating Temperature: -55°C ~ 125°C; Package / Case: 0603 (1608 Metric); Temperature Coefficient: X7R; Voltage - Rated: 25V
FB200 = BLM21AG121SN1D: No Description Available; Mfr_Name: Murata; Manufacturer: Murata Electronics; MPN: BLM21AG121SN1D
LED200 = 150080RS75000: LED; Manufacturer_Name: Wurth Elektronik; Datasheet Link: https://componentsearchengine.com/Datasheets/2/150080RS75000.pdf; Height: 0.8mm; Manufacturer_Part_Number: 150080RS75000; Mouser Part Number: 710-150080RS75000; Mouser Price/Stock: https://www.mouser.co.uk/ProductDetail/Wurth-Elektronik/150080RS75000?qs=LlUlMxKIyB2jdCo7bnfgew%3D%3D; Manufacturer: Wurth Elektronik; MPN: 150080RS75000
P200 = Header 4: Manufacturer: Wurth Elektronik; MPN: 61300411121; Publisher: Altium Limited
P201 = Header 3: Manufacturer: Mfr.:Wurth Elektronik; MPN: 61300311121; Publisher: Altium Limited
R200 = Res1: 1608[0603]; Manufacturer: YAGEO; MPN: AC0603FR-07150RL; Tolerance: 2%; Power (Watts): 1.5W; MP: -65°C ~ 155°C; Publisher: Altium Limited; Value: 150; Composition: Thick Film; Operating Temperature: -65°C ~ 155°C; Code_JEITA: Thick Film; Package: 0603 (1608 Metric); PackageReference: 1.5W; Published: Altium Limited; Temperature Coefficient: 2%
R201 = Res1: 1608[0603]; Manufacturer: YAGEO; MPN: RC0603FR-0710RL; Tolerance: 2%; Power (Watts): 1.5W; MP: -65°C ~ 155°C; Publisher: Altium Limited; Value: 10; Composition: Thick Film; Operating Temperature: -65°C ~ 155°C; Code_JEITA: Thick Film; Package: 0603 (1608 Metric); PackageReference: 1.5W; Published: Altium Limited; Temperature Coefficient: 2%
U200 = STM32L451VCT6: No Description Available; Mfr_Name: STMicroelectronics; RefDes: RefDes; Type: Type; Manufacturer: STMicroelectronics; MPN: STM32L451VCT6
U201 = CP2102-GMR: No Description Available; Mfr_Name: Silicon Labs; RefDes: RefDes; Type: Type; Manufacturer: Silicon Labs; MPN: CP2102-GMR
Y200 = ABS07-166-32.768KHZ-T: 32.768 kHz Â±10ppm Crystal 7pF 70 kOhms 2-SMD, No Lead; Value: 32768 kHz; MF: Abracon LLC; SnapEDA_Link: https://www.snapeda.com/parts/ABS07-166-32.768KHZ-T/Abracon+LLC/view-part/?ref=snap; Availability: In Stock; Price: None; Check_prices: https://www.snapeda.com/parts/ABS07-166-32.768KHZ-T/Abracon+LLC/view-part/?ref=eda; Purchase-URL: https://pricing.snapeda.com/search/part/ABS07-166-32.768KHZ-T/?ref=eda; Package: SMD-2 Abracon LLC; MP: ABS07-166-32.768KHZ-T; Manufacturer: Abracon LLC; MPN: ABS07-166-32.768KHZ-T
Y201 = ABM3-8.000MHZ-D2Y-T: No Description Available; Mfr_Name: Abracon; Manufacturer: Abracon; MPN: ABM3-8.000MHZ-D2Y-T

## Sheet LoRa_Transceiver.SchDoc
size A4; SheetNumber: 8; SheetTotal: 8
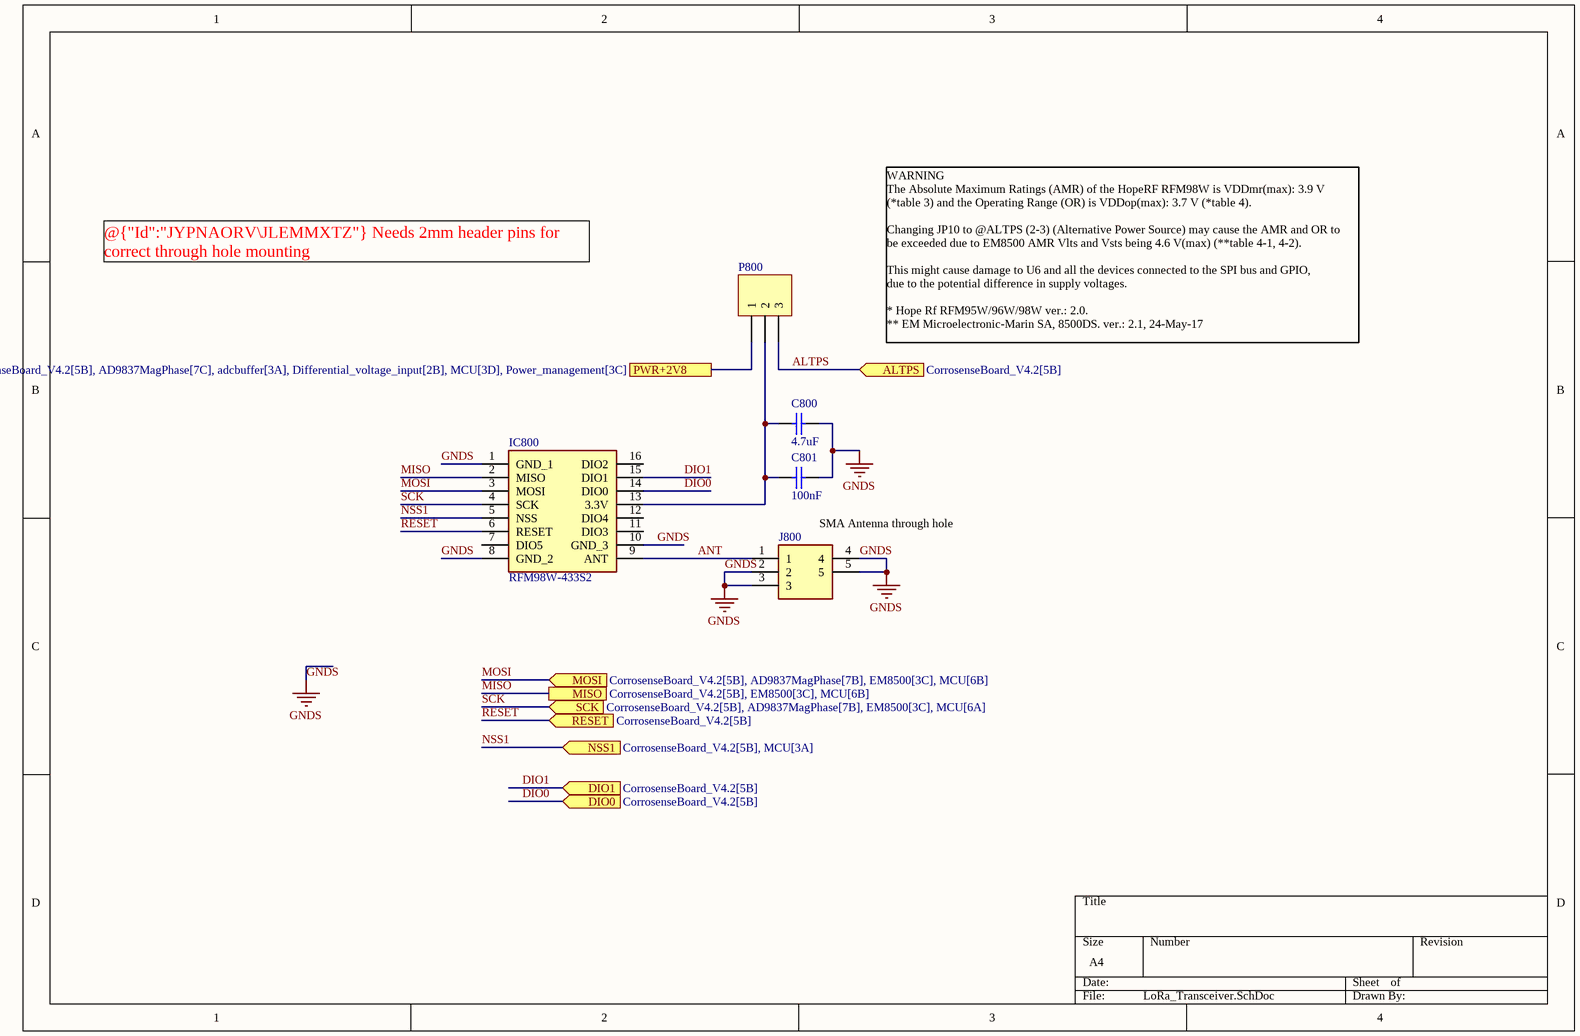
[diagram p5: LoRa_Transceiver.SchDoc]

### Parts
C800  4.7uF  [1608[0603]]
C801  100nF  [1608[0603]]
IC800  RFM98W-433S2  [RFM98W433S2]
J800  0733910070  [733910070]  (value not drawn)
P800  Header, 3-Pin  [HDR1X3]  (value not drawn)

### Ports
ALTPS (in, see CorrosenseBoard_V4.2[5B]), DIO0 (in, see CorrosenseBoard_V4.2[5B]), DIO1 (in, see CorrosenseBoard_V4.2[5B]), MISO (see CorrosenseBoard_V4.2[5B], EM8500[3C], MCU[6B]), MOSI (in, see CorrosenseBoard_V4.2[5B], AD9837MagPhase[7B], EM8500[3C], MCU[6B]), NSS1 (in, see CorrosenseBoard_V4.2[5B], MCU[3A]), PWR+2V8 (see CorrosenseBoard_V4.2[5B], AD9837MagPhase[7C], adcbuffer[3A], Differential_voltage_input[2B], MCU[3D], Power_management[3C]), RESET (in, see CorrosenseBoard_V4.2[5B]), SCK (in, see CorrosenseBoard_V4.2[5B], AD9837MagPhase[7B], EM8500[3C], MCU[6A])

### Nets
GNDS: C800.1 C801.1 IC800.1(GND_1) IC800.8(GND_2) IC800.10(GND_3) J800.2 J800.3 J800.4 J800.5
ALTPS: P800.3 ; port ALTPS
ANT: IC800.9(ANT) J800.1
DIO0: IC800.14(DIO0) ; port DIO0
DIO1: IC800.15(DIO1) ; port DIO1
MISO: IC800.2(MISO) ; port MISO
MOSI: IC800.3(MOSI) ; port MOSI
NSS1: IC800.5(NSS) ; port NSS1
PWR+2V8: P800.1 ; port PWR+2V8
RESET: IC800.6(RESET) ; port RESET
SCK: IC800.4(SCK) ; port SCK
NetC800_2: C800.2 C801.2 IC800.13(3.3V) P800.2

Not connected (* = marked no-connect by the designer): IC800 7(DIO5) 11(DIO3) 12(DIO4) 16(DIO2)

### Notes on the sheet
- Type @ to refer to a designator or a net
- @{"Id":"JYPNAORV\JLEMMXTZ"} Needs 2mm header pins for correct through hole mounting
- WARNING
  The Absolute Maximum Ratings (AMR) of the HopeRF RFM98W is VDDmr(max): 3.9 V
  (*table 3) and the Operating Range (OR) is VDDop(max): 3.7 V (*table 4).
  Changing JP10 to @ALTPS (2-3) (Alternative Power Source) may cause the AMR and OR to
  be exceeded due to EM8500 AMR Vlts and Vsts being 4.6 V(max) (**table 4-1, 4-2).
  This might cause damage to U6 and all the devices connected to the SPI bus and GPIO,
  due to the potential difference in supply voltages.
  * Hope Rf RFM95W/96W/98W ver.: 2.0.
  ** EM Microelectronic-Marin SA, 8500DS. ver.: 2.1, 24-May-17
- SMA Antenna through hole

### Library data of the parts
C800 = Cap: as C502 on sheet EM8500; Value: 4.7uF; Operating Temperature: -55°C ~ 125°C; Package / Case: 0603 (1608 Metric); Temperature Coefficient: X7R; Voltage - Rated: 25V
C801 = Cap: as C702 on sheet adcbuffer; Value: 100nF; Operating Temperature: -55°C ~ 125°C; Package / Case: 0603 (1608 Metric); Temperature Coefficient: X7R; Voltage - Rated: 25V
IC800 = RFM98W-433S2: Integrated Circuit; Manufacturer_Name: RF SOLUTIONS; Datasheet Link: https://datasheet.datasheetarchive.com/originals/distributors/DKDS-13/248812.pdf; Height: 1.8mm; Manufacturer_Part_Number: RFM98W-433S2; Mouser Part Number: 223-RFM98W-433S2; Mouser Price/Stock: https://www.mouser.co.uk/ProductDetail/RF-Solutions/RFM98W-433S2?qs=OlC7AqGiEDlY9molZxTrLQ%3D%3D; Manufacturer: RF SOLUTIONS; MPN: RFM98W-433S2
J800 = 0733910070: Connector; Manufacturer_Name: Molex; MPN: 73391-0070; Datasheet Link: https://www.molex.com/pdm_docs/sd/733910070_sd.pdf; Height: 10mm; Manufacturer_Part_Number: 0733910070; Mouser Part Number: N/A; Mouser Price/Stock: https://www.mouser.co.uk/ProductDetail/Molex/0733910070?qs=PBcRNPEHKsq1tOlFMTxPGQ%3D%3D; Arrow Part Number: 0733910070; Arrow Price/Stock: https://www.arrow.com/en/products/0733910070/molex; Manufacturer: Molex
P800 = Header 3: as P105 on sheet CorrosenseBoard_V4.2; Publisher: Altium Limited

## Sheet Power_management.SchDoc
size A4; SheetNumber: 4; SheetTotal: 8
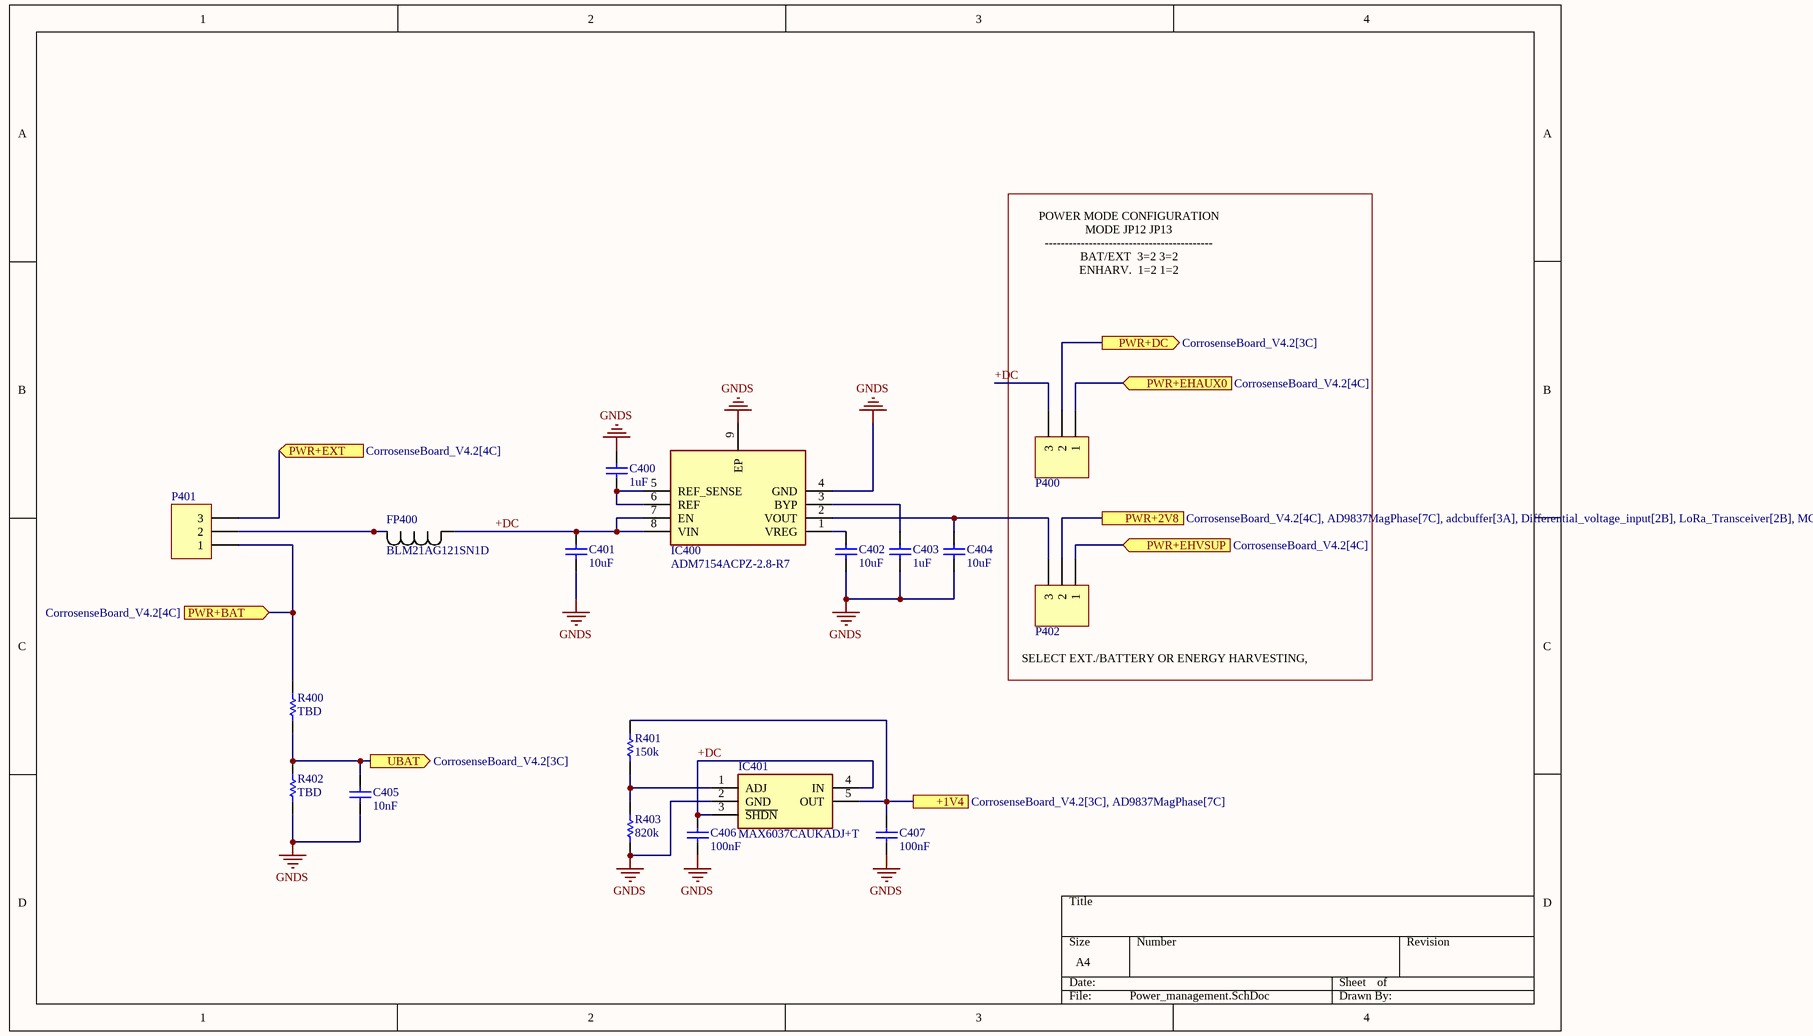
[diagram p6: Power_management.SchDoc]

### Parts
C400  1uF  [1608[0603]]
C401  10uF  [1608[0603]]
C402  10uF  [1608[0603]]
C403  1uF  [1608[0603]]
C404  10uF  [1608[0603]]
C405  10nF  [1608[0603]]
C406  100nF  [1608[0603]]
C407  100nF  [1608[0603]]
FP400  BLM21AG121SN1D  [BEADC2012X105N]
IC400  ADM7154ACPZ-2.8-R7  [SON50P300X300X80-9N-D]
IC401  MAX6037CAUKADJ+T  [SOT95P280X145-5N]
P400  Header, 3-Pin  [HDR1X3]  (value not drawn)
P401  Header, 3-Pin  [HDR1X3]  (value not drawn)
P402  Header, 3-Pin  [HDR1X3]  (value not drawn)
R400  value TBD  [1608[0603]]
R401  150k  [1608[0603]]
R402  value TBD  [1608[0603]]
R403  820k  [1608[0603]]

### Blocks framed on the sheet
SELECT EXT./BATTERY OR ENERGY HARVESTING,: P400 P402

### Ports
+1V4 (see CorrosenseBoard_V4.2[3C], AD9837MagPhase[7C]), PWR+2V8 (see CorrosenseBoard_V4.2[4C], AD9837MagPhase[7C], adcbuffer[3A], Differential_voltage_input[2B], LoRa_Transceiver[2B], MCU[3D]), PWR+BAT (in, see CorrosenseBoard_V4.2[4C]), PWR+DC (out, see CorrosenseBoard_V4.2[3C]), PWR+EHAUX0 (in, see CorrosenseBoard_V4.2[4C]), PWR+EHVSUP (in, see CorrosenseBoard_V4.2[4C]), PWR+EXT (in, see CorrosenseBoard_V4.2[4C]), UBAT (out, see CorrosenseBoard_V4.2[3C])

### Nets
GNDS: C400.1 C401.2 C402.1 C403.2 C404.2 C405.1 C406.2 C407.2 IC400.4(GND) IC400.9(EP) IC401.2(GND) R402.1 R403.1
+DC: C401.1 C406.1 FP400.2 IC400.7(EN) IC400.8(VIN) IC401.3(~{SHDN}) IC401.4(IN) P400.3
IN6: C405.2 R400.1 R402.2 ; port UBAT
PWR+2V8: P402.2 ; port PWR+2V8
PWR+DC: P400.2 ; port PWR+DC
VBUS: P401.3 ; port PWR+EXT
VCOM: C407.1 IC401.5(OUT) R401.2 ; port +1V4
NetC400_2: C400.2 IC400.5(REF_SENSE) IC400.6(REF)
NetC402_2: C402.2 IC400.1(VREG)
NetC403_1: C403.1 IC400.3(BYP)
NetC404_1: C404.1 IC400.2(VOUT) P402.3
NetC504_1: P402.1 ; port PWR+EHVSUP
NetC505_2: P400.1 ; port PWR+EHAUX0
NetFP400_1: FP400.1 P401.2
NetIC401_1: IC401.1(ADJ) R401.1 R403.2
NetJ101_1: P401.1 R400.2 ; port PWR+BAT

### Notes on the sheet
- Type @ to refer to a designator or a net
- POWER MODE CONFIGURATION
  MODE	JP12	JP13
  ------------------------------------------
  BAT/EXT  3=2	3=2
  ENHARV.  1=2	1=2

### Library data of the parts
C400 C403 = Cap: as C504 on sheet EM8500; Value: 1uF; Operating Temperature: -55°C ~ 125°C; Package / Case: 0603 (1608 Metric); Temperature Coefficient: X7R; Voltage - Rated: 25V
C401 C402 C404 = Cap: CAP CER 25V X7R 0603; Manufacturer: Murata Electronics; MPN: GRM188R61E106KA73D; Tolerance: ±10%; Value: 10uF; Operating Temperature: -55°C ~ 125°C; Package / Case: 0603 (1608 Metric); Temperature Coefficient: X7R; Voltage - Rated: 25V
C405 = Cap: as C700 on sheet adcbuffer; Value: 10nF; Operating Temperature: -55°C ~ 125°C; Package / Case: 0603 (1608 Metric); Temperature Coefficient: X7R; Voltage - Rated: 25V
C406 C407 = Cap: as C702 on sheet adcbuffer; Value: 100nF; Operating Temperature: -55°C ~ 125°C; Package / Case: 0603 (1608 Metric); Temperature Coefficient: X7R; Voltage - Rated: 25V
FP400 = BLM21AG121SN1D: as FB200 on sheet MCU; MPN: BLM21AG121SN1D
IC400 = ADM7154ACPZ-2.8-R7: Integrated Circuit; Manufacturer_Name: Analog Devices; Datasheet Link: https://componentsearchengine.com/Datasheets/1/ADM7154ACPZ-2.8-R7.pdf; Height: 0.8mm; Manufacturer_Part_Number: ADM7154ACPZ-2.8-R7; Mouser Part Number: 584-ADM7154ACPZ2.8R7; Mouser Price/Stock: https://www.mouser.co.uk/ProductDetail/Analog-Devices/ADM7154ACPZ-2.8-R7?qs=iCT64eccu7gPTq8Fv%2FiWJw%3D%3D; Arrow Part Number: ADM7154ACPZ-2.8-R7; Arrow Price/Stock: https://www.arrow.com/en/products/adm7154acpz-2.8-r7/analog-devices?region=nac; Manufacturer: Analog Devices; MPN: ADM7154ACPZ-2.8-R7
IC401 = MAX6037CAUKADJ+T: Integrated Circuit; Manufacturer_Name: Analog Devices; Datasheet Link: https://componentsearchengine.com/Datasheets/2/MAX6037CAUKADJ+T.pdf; Height: 1.45mm; Manufacturer_Part_Number: MAX6037CAUKADJ+T; Mouser Part Number: 700-MAX6037CAUKADJT; Mouser Price/Stock: https://www.mouser.co.uk/ProductDetail/Maxim-Integrated/MAX6037CAUKADJ%2bT?qs=GxOUx7aO6nwbjANjomWkGA%3D%3D; Arrow Part Number: MAX6037CAUKADJ+T; Arrow Price/Stock: https://www.arrow.com/en/products/max6037caukadjt/maxim-integrated?region=nac; Manufacturer: Analog Devices; MPN: MAX6037CAUKADJ+T
P400-P402 = Header 3: as P105 on sheet CorrosenseBoard_V4.2; Publisher: Altium Limited
R400 R402 = Res1: RES SMD 2% 1.5W 0603; MP: -65°C ~ 155°C; Publisher: Altium Limited; Code_JEITA: Thick Film; Package: 0603 (1608 Metric); Temperature Coefficient: 2%; Composition: Thick Film; Operating Temperature: -65°C ~ 155°C; Power (Watts): 1.5W; Tolerance: 2%; Manufacturer: *; MPN: *
R401 = Res1: RES SMD 2% 1.5W 0603; Manufacturer: YAGEO; MPN: AC0603FR-07150KL; MP: -65°C ~ 155°C; Publisher: Altium Limited; Value: 150k; Code_JEITA: Thick Film; Package: 0603 (1608 Metric); Temperature Coefficient: 2%; Composition: Thick Film; Operating Temperature: -65°C ~ 155°C; Power (Watts): 1.5W; Tolerance: 2%
R403 = Res1: RES SMD 2% 1.5W 0603; Manufacturer: YAGEO; MPN: AC0603FR-07820KL; MP: -65°C ~ 155°C; Publisher: Altium Limited; Value: 820k; Code_JEITA: Thick Film; Package: 0603 (1608 Metric); Temperature Coefficient: 2%; Composition: Thick Film; Operating Temperature: -65°C ~ 155°C; Power (Watts): 1.5W; Tolerance: 2%

## Sheet AD9837MagPhase.SchDoc
size A3; SheetNumber: 3; SheetTotal: 8
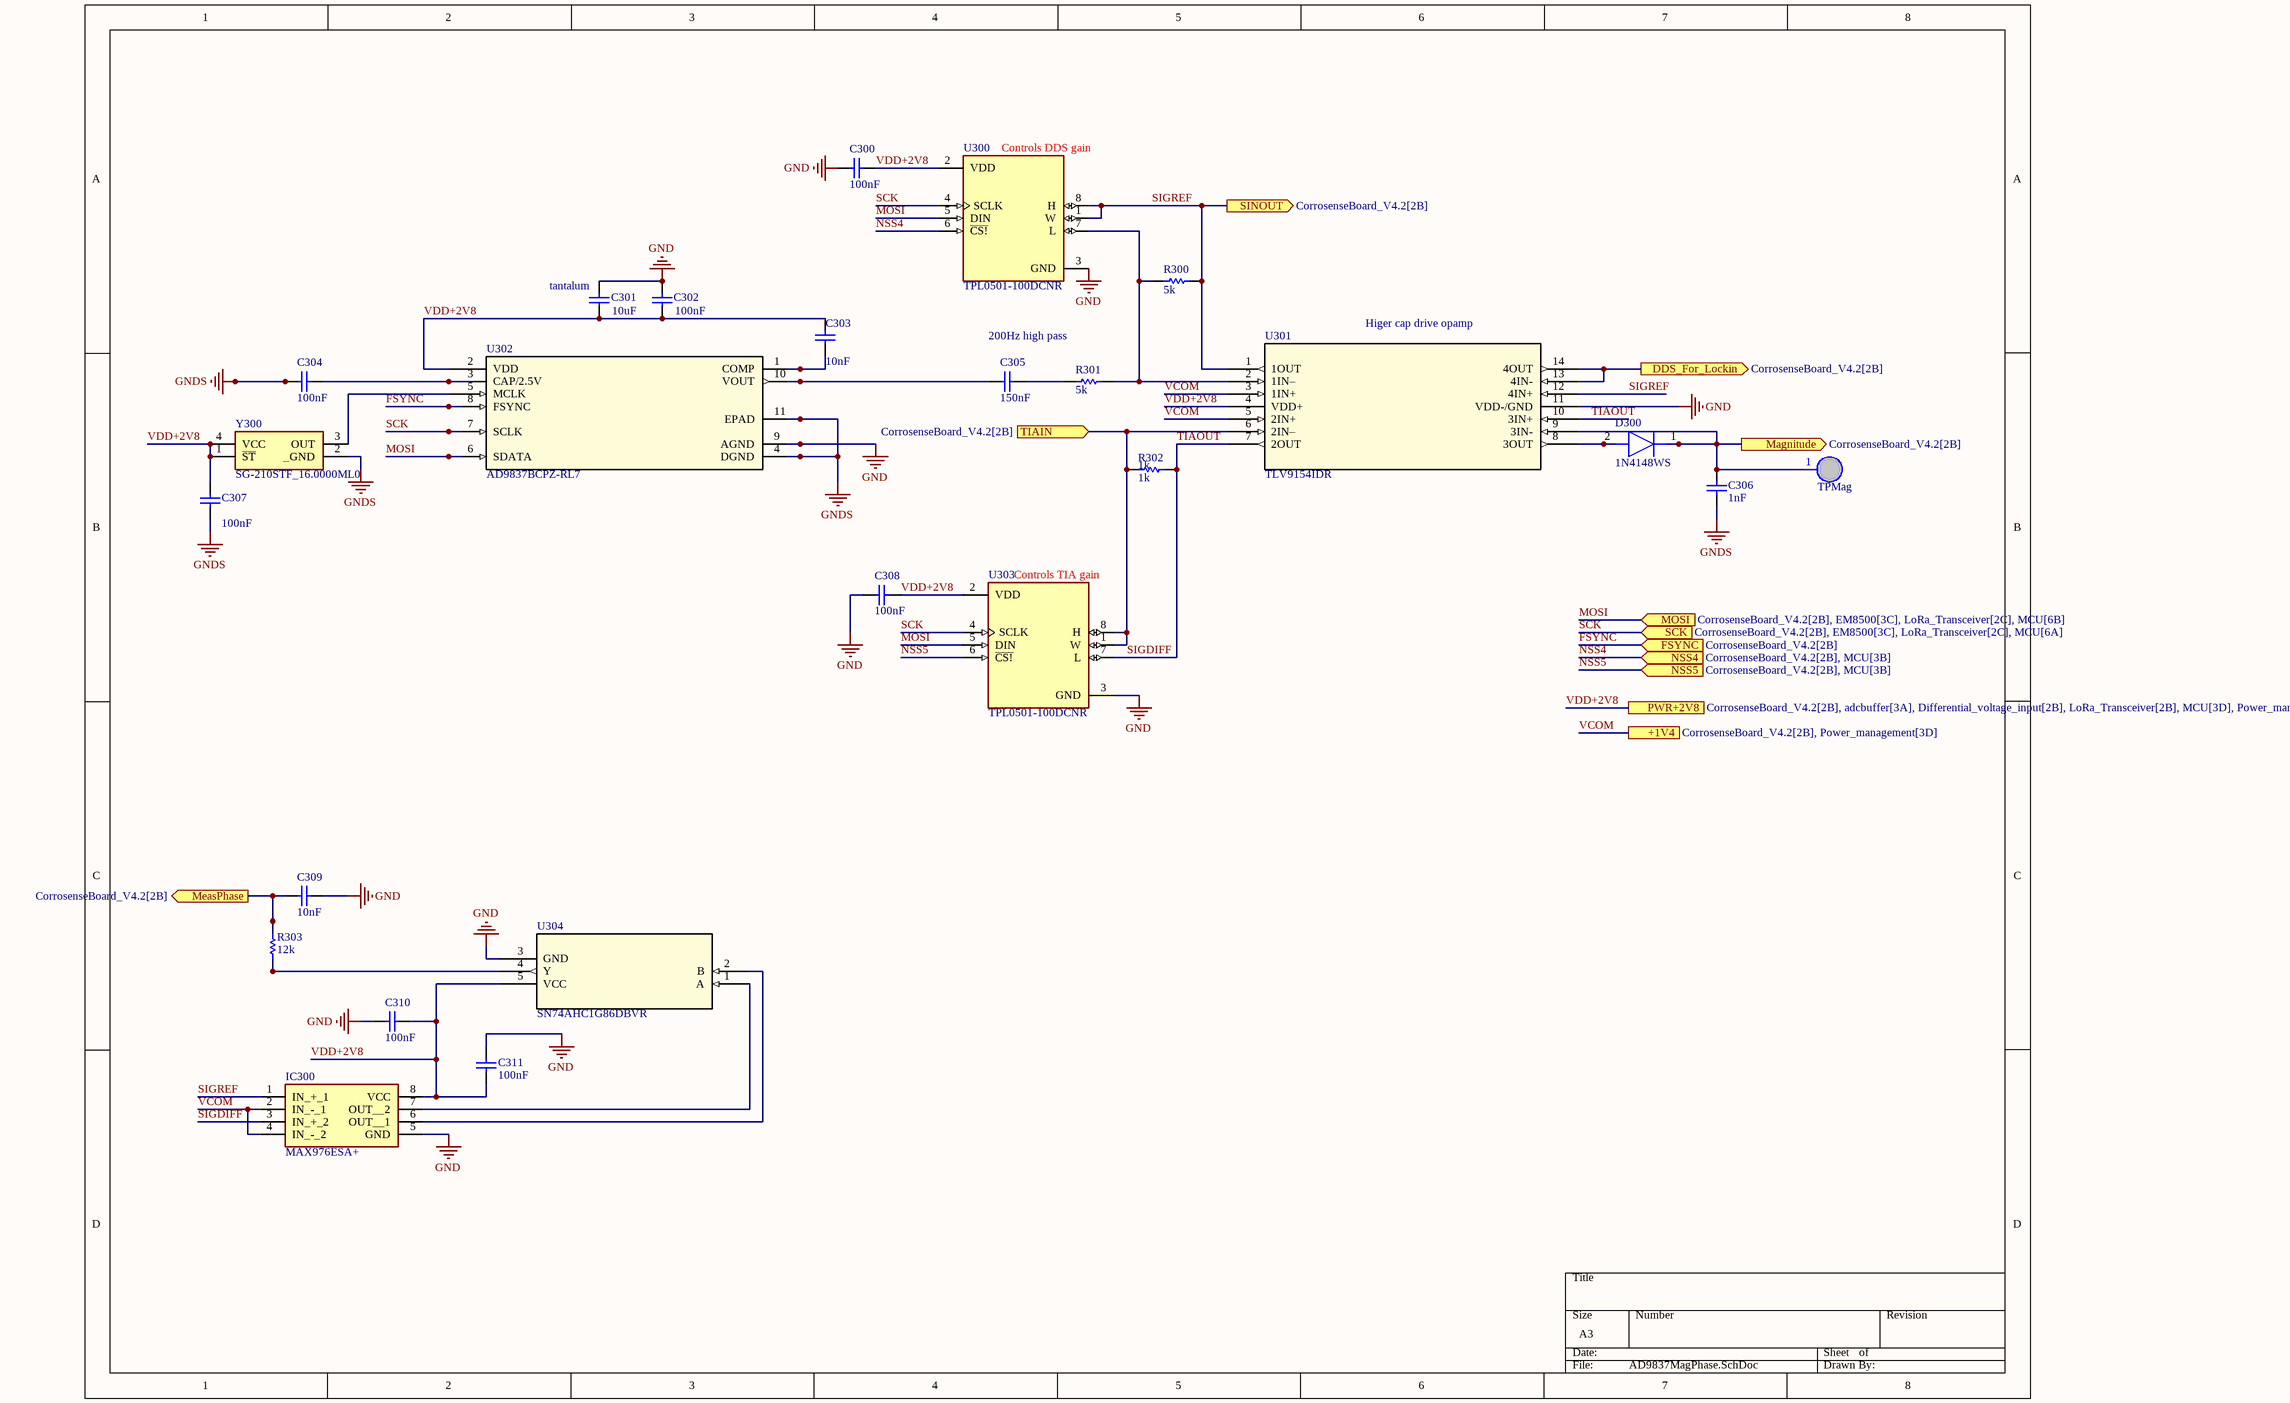
[diagram p7: AD9837MagPhase.SchDoc]

### Parts
C300  100nF  [1608[0603]]
C301  value 10uF  [1608[0603]]  (hidden comment: 10uF Tantalum)
C302  100nF  [1608[0603]]
C303  10nF  [1608[0603]]
C304  100nF  [1608[0603]]
C305  150nF  [1608[0603]]
C306  1nF  [1608[0603]]
C307  100nF  [1608[0603]]
C308  100nF  [1608[0603]]
C309  10nF  [1608[0603]]
C310  100nF  [1608[0603]]
C311  100nF  [1608[0603]]
D300  1N4148WS  [SOD2513X100N]
IC300  MAX976ESA+  [SOIC127P600X175-8N]
R300  5k  [1608[0603]]
R301  5k  [1608[0603]]
R302  1k  [1608[0603]]
R303  12k  [1608[0603]]
TPMag  TP  [PCBComponent_1]  (value not drawn)  (no BOM)
U300  TPL0501-100DCNR  [SOT65P280X145-8N]
U301  TLV9154IDR  [SOIC127P600X175-14N]
U302  AD9837BCPZ-RL7  [CP_10_9_ADI]
U303  TPL0501-100DCNR  [SOT65P280X145-8N]
U304  SN74AHC1G86DBVR  [SOT95P280X145-5N]
Y300  SG-210STF_16.0000ML0  [SG210STF160000ML0]

### Ports
+1V4 (see CorrosenseBoard_V4.2[2B], Power_management[3D]), DDS_For_Lockin (out, see CorrosenseBoard_V4.2[2B]), FSYNC (in, see CorrosenseBoard_V4.2[2B]), Magnitude (out, see CorrosenseBoard_V4.2[2B]), MeasPhase (out, see CorrosenseBoard_V4.2[2B]), MOSI (in, see CorrosenseBoard_V4.2[2B], EM8500[3C], LoRa_Transceiver[2C], MCU[6B]), NSS4 (in, see CorrosenseBoard_V4.2[2B], MCU[3B]), NSS5 (in, see CorrosenseBoard_V4.2[2B], MCU[3B]), PWR+2V8 (see CorrosenseBoard_V4.2[2B], adcbuffer[3A], Differential_voltage_input[2B], LoRa_Transceiver[2B], MCU[3D], Power_management[3C]), SCK (in, see CorrosenseBoard_V4.2[2B], EM8500[3C], LoRa_Transceiver[2C], MCU[6A]), SINOUT (out, see CorrosenseBoard_V4.2[2B]), TIAIN (in, see CorrosenseBoard_V4.2[2B])

### Nets
GND: C300.2 C301.2 C302.2 C308.2 C309.2 C310.2 C311.1 IC300.5(GND) U300.3(GND) U301.11(VDD-/GND) U302.9(AGND) U303.3(GND) U304.3(GND)
GNDS: C304.2 C306.2 C307.1 U302.4(DGND) U302.11(EPAD) Y300.2(_GND)
DDS_For_Lockin: U301.13(4IN-) U301.14(4OUT) ; port DDS_For_Lockin
FSYNC: U302.8(FSYNC) ; port FSYNC
MeasMag: C306.1 D300.1(K) TPMag.1 U301.9(3IN-) ; port Magnitude
MeasPhase: C309.1 R303.2 ; port MeasPhase
MOSI: U300.5(DIN) U302.6(SDATA) U303.5(DIN) ; port MOSI
NSS4: U300.6(~{CS!}) ; port NSS4
NSS5: U303.6(~{CS!}) ; port NSS5
SCK: U300.4(SCLK) U302.7(SCLK) U303.4(SCLK) ; port SCK
SIGDIFF: IC300.3(IN_+_2) R302.1 U301.7(2OUT) U301.10(3IN+) U303.7(L)  [also labelled TIAOUT]
SIGREF: IC300.1(IN_+_1) R300.1 U300.1(W) U300.8(H) U301.1(1OUT) U301.12(4IN+) ; port SINOUT
TIAIN: R302.2 U301.6(2IN–) U303.1(W) U303.8(H) ; port TIAIN
VCOM: IC300.2(IN_-_1) IC300.4(IN_-_2) U301.3(1IN+) U301.5(2IN+) ; port +1V4
VDD+2V8: C300.1 C301.1 C302.1 C303.2 C307.2 C308.1 C310.1 C311.2 IC300.8(VCC) U300.2(VDD) U301.4(VDD+) U302.2(VDD) U303.2(VDD) U304.5(VCC) Y300.1(~{ST}) Y300.4(VCC) ; port PWR+2V8  [project net PWR+2V8]
NetC303_1: C303.1 U302.1(COMP)
NetC304_1: C304.1 U302.3(CAP/2.5V)
NetC305_1: C305.1 R301.2
NetC305_2: C305.2 U302.10(VOUT)
NetD300_2: D300.2(A) U301.8(3OUT)
NetIC300_6: IC300.6(OUT__1) U304.2(B)
NetIC300_7: IC300.7(OUT__2) U304.1(A)
NetR300_2: R300.2 R301.1 U300.7(L) U301.2(1IN–)
NetR303_1: R303.1 U304.4(Y)
NetU302_5: U302.5(MCLK) Y300.3(OUT)

### Notes on the sheet
- (near U300) Controls DDS gain
- (near C301) tantalum
- 200Hz high pass
- (near U301) Higer cap drive opamp
- (near U303) Controls TIA gain

### Library data of the parts
C300 C302 C304 C307 C308 C310 C311 = Cap: as C702 on sheet adcbuffer; Value: 100nF; Operating Temperature: -55°C ~ 125°C; Package / Case: 0603 (1608 Metric); Temperature Coefficient: X7R; Voltage - Rated: 25V
  C302 C304 C307 C310 C311: Series: *
C301 = Cap: CAP CER 25V X7R 0603; Manufacturer: Vishay / Sprague; MPN: TR8M106M010C2000; Tolerance: ±20%; Voltage - Rated: 10V; ESR: 2Ohm; Temperature Coefficient: X7R; Operating Temperature: -55°C ~ 125°C; Package / Case: 0603 (1608 Metric); Series: MICROTAN®, TR8
C303 C309 = Cap: as C700 on sheet adcbuffer; Value: 10nF; Voltage - Rated: 25V; Temperature Coefficient: X7R; Operating Temperature: -55°C ~ 125°C; Package / Case: 0603 (1608 Metric); Series: *
C305 = Cap: as C603 on sheet Differential_voltage_input; Value: 150nF; Voltage - Rated: 25V; Temperature Coefficient: X7R; Operating Temperature: -55°C ~ 125°C; Package / Case: 0603 (1608 Metric); Series: *
C306 = Cap: as C601 on sheet Differential_voltage_input; Value: 1nF; Voltage - Rated: 25V; Temperature Coefficient: X7R; Operating Temperature: -55°C ~ 125°C; Package / Case: 0603 (1608 Metric); Series: *
D300 = 1N4148WS: Diode; Manufacturer_Name: Taiwan Semiconductor; Datasheet Link: https://www.taiwansemi.com/products/datasheet/1N4148WS-G_B14.pdf; Height: 1mm; Manufacturer_Part_Number: 1N4148WS; Mouser Part Number: 821-1N4148WS; Mouser Price/Stock: https://www.mouser.co.uk/ProductDetail/Taiwan-Semiconductor/1N4148WS?qs=tHU%2FlV7kTyTKfOMbqYjjTA%3D%3D; Arrow Part Number: 1N4148WS; Arrow Price/Stock: https://www.arrow.com/en/products/1n4148ws/taiwan-semiconductor?region=nac; Manufacturer: Taiwan Semiconductor; MPN: 1N4148WS
IC300 = MAX976ESA+: Integrated Circuit; Manufacturer_Name: Analog Devices; Datasheet Link: http://datasheets.maximintegrated.com/en/ds/MAX976-MAX998.pdf; Height: 1.75mm; Manufacturer_Part_Number: MAX976ESA+; Mouser Part Number: 700-MAX976ESA; Mouser Price/Stock: https://www.mouser.co.uk/ProductDetail/Analog-Devices-Maxim-Integrated/MAX976ESA%2b?qs=1THa7WoU59E0ZNiXLt8Seg%3D%3D; Arrow Part Number: MAX976ESA+; Arrow Price/Stock: https://www.arrow.com/en/products/max976esa/maxim-integrated?region=nac; Manufacturer: Analog Devices; MPN: MAX976ESA+
R300 R301 = Res1: RES SMD 2% 1.5W 0603; Manufacturer: YAGEO; MPN: AC0603FR-134K99L; MP: -65°C ~ 155°C; Publisher: Altium Limited; Value: 5k; Code_JEITA: Thick Film; Package: 0603 (1608 Metric); Temperature Coefficient: 2%; Composition: Thick Film; Operating Temperature: -65°C ~ 155°C; Power (Watts): 1.5W; Tolerance: 2%
R302 = Res1: as R601 on sheet Differential_voltage_input; Publisher: Altium Limited; Value: 1k; Code_JEITA: Thick Film; Package: 0603 (1608 Metric); Temperature Coefficient: 2%; Composition: Thick Film; Operating Temperature: -65°C ~ 155°C; Power (Watts): 1.5W; Tolerance: 2%
R303 = Res1: RES SMD 2% 1.5W 0603; Manufacturer: YAGEO; MPN: AC0603FR-1012KL; MP: -65°C ~ 155°C; Publisher: Altium Limited; Value: 12k; Code_JEITA: Thick Film; Package: 0603 (1608 Metric); Temperature Coefficient: 2%; Composition: Thick Film; Operating Temperature: -65°C ~ 155°C; Power (Watts): 1.5W; Tolerance: 2%
U300 U303 = TPL0501-100DCNR: 256-Taps, 100k, Single-Channel Potentiometer With SPI Interface 8-SOT-23 -40 to 125; Manufacturer: Texas Instruments; Price: None; MP: TPL0501-100DCNR; Availability: Unavailable; Package: None; Value: *; MPN: TPL0501-100DCNR
U301 = TLV2444CD: as U700 on sheet adcbuffer; RefDes: RefDes; Type: Type; Manufacturer: Texas Instruments; MPN: TLV9154IDR
U302 = AD9837ACPZ-RL7: No Description Available; Mfr_Name: Analog Devices Inc; Manufacturer: Analog Devices; RefDes: RefDes; Type: Type; MPN: AD9837BCPZ-RL7
U304 = SN74AHC1G86DBVR: No Description Available; Mfr_Name: Texas Instruments; RefDes: RefDes; Type: Type; Manufacturer: Texas Instruments; MPN: SN74AHC1G86DBVR
Y300 = SG-210STF_16.0000ML0: Crystal or Oscillator; Manufacturer_Name: Epson Timing; Manufacturer_Part_Number: SG-210STF 16.0000ML0; Datasheet Link: https://support.epson.biz/td/api/doc_check.php?dl=brief_SG-210STF_en.pdf; Height: 0.9mm; Mouser Part Number: 732-SG-210STF16ML0; Mouser Price/Stock: https://www.mouser.co.uk/ProductDetail/Epson-Timing/SG-210STF-16.0000ML0?qs=MyNHzdoqoQIOzqs41oAYSA%3D%3D; Manufacturer: Epson Timing; MPN: SG-210STF 16.0000ML0
TPMag = TP: Manufacturer: *; MPN: *